# EAGLE design CD (EAGLE 7.2.0)

## Sheet 1 of 3
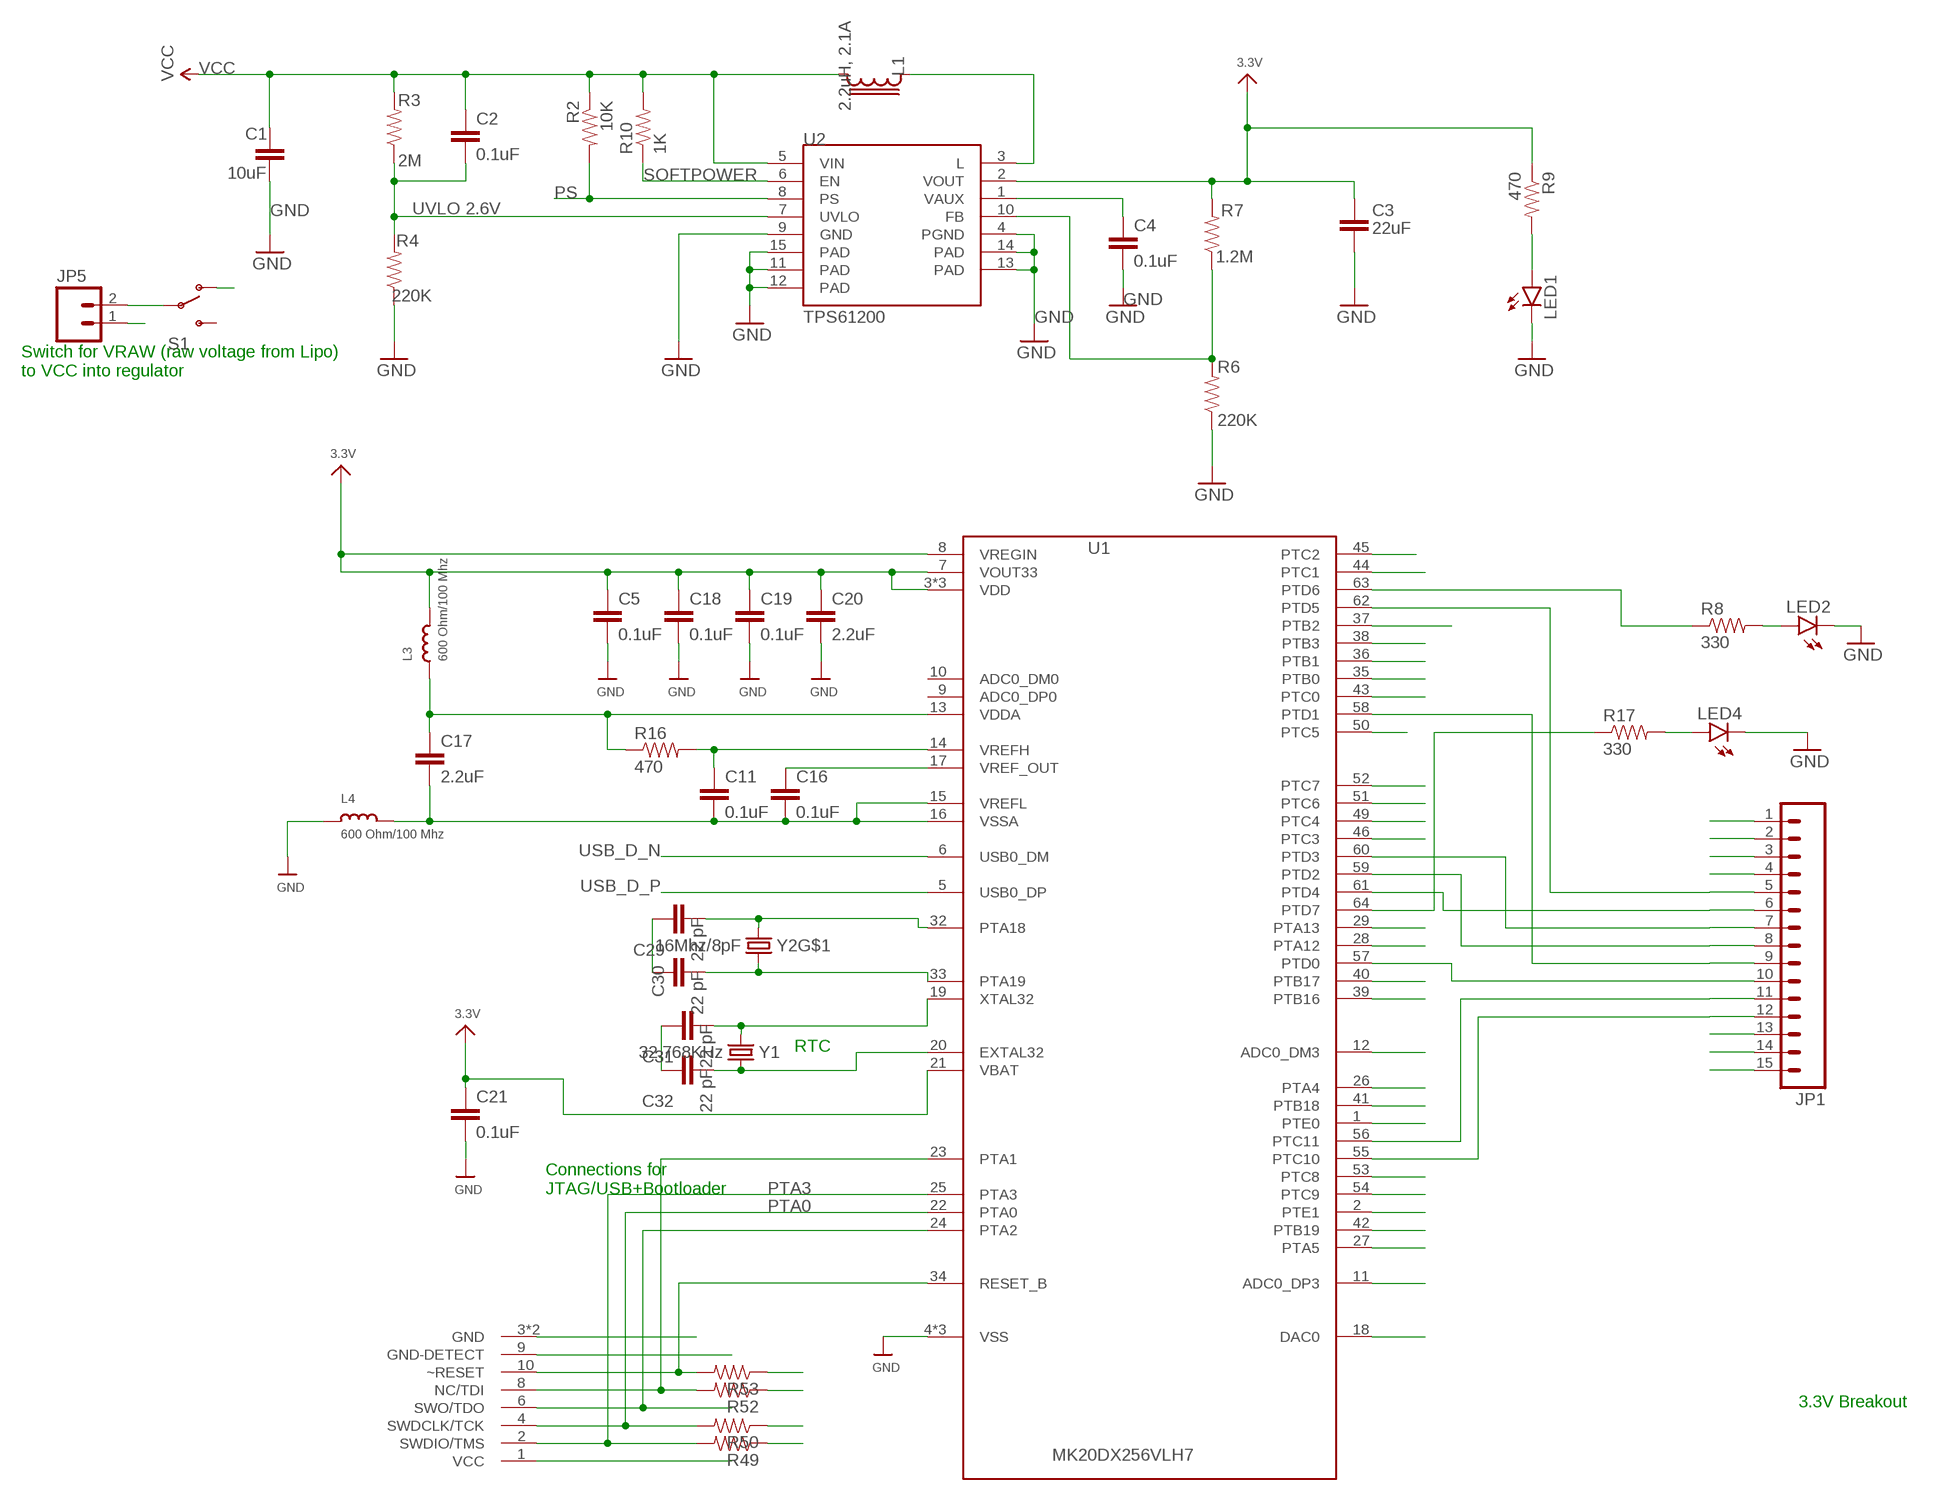
[diagram p0: schematic, sheet 1]

### Parts
C1  10uF  CAPACITOR-10UF  [0603-CAP]
C2  0.1uF  CAPACITOR-0.1UF  [0603-CAP]
C3  22uF  CAPACITOR-22UF  [0603-CAP]
C4  0.1uF  CAPACITOR-0.1UF  [0603-CAP]
C5  0.1uF  CAPACITOR-0.1UF  [0603-CAP]
C11  0.1uF  CAPACITOR-0.1UF  [0603-CAP]
C16  0.1uF  CAPACITOR-0.1UF  [0603-CAP]
C17  2.2uF  CAPACITOR-2.2UF  [0603-CAP]
C18  0.1uF  CAPACITOR-0.1UF  [0603-CAP]
C19  0.1uF  CAPACITOR-0.1UF  [0603-CAP]
C20  2.2uF  CAPACITOR-2.2UF  [0603-CAP]
C21  0.1uF  CAPACITOR-0.1UF  [0603-CAP]
C29  22 pF  CAPACITOR-10UF  [0603-CAP]
C30  22 pF  CAPACITOR-10UF  [0603-CAP]
C31  22 pF  CAPACITOR-10UF  [0603-CAP]
C32  22 pF  CAPACITOR-10UF  [0603-CAP]
JP1  M15  [1X15]
JP5  M02PTH  [1X02]
L1  2.2uH, 2.1A  LPS30152.2UH  [LPS3015]
L3  600 Ohm/100 Mhz  INDUCTOR-BK2125HM601-T  [0805]
L4  600 Ohm/100 Mhz  INDUCTOR-BK2125HM601-T  [0805]
LED1  LED-GREEN  [LED-0603]
LED2  LED-GREEN  [LED-0603]
LED4  LED-GREEN  [LED-0603]
R2  10K  RESISTOR-10K  [0603-RES]
R3  2M  RESISTOR-2M  [0603-RES]
R4  220K  RESISTOR-220K  [0603-RES]
R6  220K  RESISTOR-220K  [0603-RES]
R7  1.2M  RESISTOR-1.2M  [0603-RES]
R8  330  RESISTOR-470  [0603-RES]
R9  470  RESISTOR-470  [0603-RES]
R10  1K  RESISTOR-1K  [0603-RES]
R16  470  RESISTOR-470  [0603-RES]
R17  330  RESISTOR-470  [0603-RES]
R49  RESISTOR0402-RES  [0402-RES]
R50  RESISTOR0402-RES  [0402-RES]
R52  RESISTOR0402-RES  [0402-RES]
R53  RESISTOR0402-RES  [0402-RES]
S1  SWITCH-SPDT-SMD-A  [SWITCH-SPST-SMD-A]
U1  MK20DX256VLH7  [MK20DX256VLH7]
U2  TPS61200  [QFN-10_PAD]
U$7  2X5_0.05"_CORTEX_DEBUGTH_NOKEY_UNSHROUDED  [2X5_0.05"_TH_NS]
Y1  32.768KHz  CRYSTAL/32.768KHZ/SMD-TXC_7A  [CRYSTAL-TXC-7A]
Y2  16Mhz/8pF  CRYSTAL/SMD-5X3-GND16MHZ/8PF  [CRYSTAL-SMD-5X3]

### Nets
3.3V: C3.1 C5.1 C18.1 C19.1 C20.1 C21.1 JP1.13 JP1.14 JP1.15 L3.2 R7.2 R9.1 R49.1 R52.1 R53.1 U1.3(VDD) U1.7(VOUT33) U1.8(VREGIN) U1.21(VBAT) U1.30(VDD) U1.48(VDD) U2.2(VOUT) U$7.1(VCC) ; also sheet 2,3
A12: U1.11(ADC0_DP3)
A13: U1.12(ADC0_DM3)
AD0: U1.45(PTC2) ; also sheet 2
DAC/A14: U1.18(DAC0)
FB: R6.2 R7.1 U2.10(FB)
GND [Top GND Pour]: C1.2 C3.2 C4.2 C5.2 C18.2 C19.2 C20.2 C21.2 C29.1 C30.1 C31.1 C32.1 JP1.1 JP1.2 JP1.3 JP1.4 JP5.1 L4.1 LED1.C LED2.C LED4.C R4.1 R6.1 R50.1 U1.4(VSS) U1.31(VSS) U1.47(VSS) U2.4(PGND) U2.9(GND) U2.11(PAD) U2.12(PAD) U2.13(PAD) U2.14(PAD) U2.15(PAD) U$7.3(GND) U$7.5(GND) U$7.9(GND-DETECT) ; also sheet 2,3
N$1: LED1.A R9.2
N$2: L1.1 U2.3(L)
N$7: LED2.A R8.2
N$10: C31.2 U1.19(XTAL32) Y1.P$2
N$11: C32.2 U1.20(EXTAL32) Y1.P$1
N$27: C29.2 U1.32(PTA18) Y2.3
N$28: C30.2 U1.33(PTA19) Y2.1
N$29: LED4.A R17.2
PS: R2.2 U2.8(PS)
PTA0: R50.2 U1.22(PTA0) U$7.4(SWDCLK/TCK)
PTA1: R52.2 U1.23(PTA1) U$7.8(NC/TDI)
PTA2: U1.24(PTA2) U$7.6(SWO/TDO)
PTA3: R49.2 U1.25(PTA3) U$7.2(SWDIO/TMS)
PTA4: U1.26(PTA4)
PTA5: U1.27(PTA5)
PTA12: U1.28(PTA12)
PTA13: U1.29(PTA13)
PTB0: U1.35(PTB0) ; also sheet 2
PTB1: U1.36(PTB1) ; also sheet 2
PTB16: U1.39(PTB16) ; also sheet 2
PTB17: U1.40(PTB17) ; also sheet 2
PTB18: U1.41(PTB18) ; also sheet 2
PTB19: U1.42(PTB19) ; also sheet 2
PTC0: U1.43(PTC0) ; also sheet 2
PTC1: U1.44(PTC1) ; also sheet 2
PTC3: U1.46(PTC3) ; also sheet 2
PTC4: U1.49(PTC4) ; also sheet 2
PTC5: U1.50(PTC5) ; also sheet 2
PTC6: U1.51(PTC6) ; also sheet 2
PTC7: U1.52(PTC7) ; also sheet 2
PTC8: U1.53(PTC8) ; also sheet 2
PTC9: U1.54(PTC9) ; also sheet 2
PTC10: JP1.12 U1.55(PTC10)
PTC11: JP1.11 U1.56(PTC11)
PTD0: JP1.10 U1.57(PTD0)
PTD1: JP1.9 U1.58(PTD1)
PTD2: JP1.8 U1.59(PTD2)
PTD3: JP1.7 U1.60(PTD3)
PTD4: JP1.6 U1.61(PTD4)
PTD5: JP1.5 U1.62(PTD5)
PTD6: R8.1 U1.63(PTD6)
PTD7: R17.1 U1.64(PTD7)
PTE0: U1.1(PTE0)
PTE1: U1.2(PTE1)
RESET_B: R53.2 U1.34(RESET_B) U$7.10(~RESET)
SCL: U1.37(PTB2) ; also sheet 2,3
SDA: U1.38(PTB3) ; also sheet 2,3
SOFTPOWER: R10.1 U2.6(EN)
USB_D_N [USB]: U1.6(USB0_DM)
USB_D_P [USB]: U1.5(USB0_DP)
UVLO: C2.2 R3.1 R4.2 U2.7(UVLO)
VAUX: C4.1 U2.1(VAUX)
VCC: C1.1 C2.1 L1.2 R2.1 R3.2 R10.2 S1.1(O) U2.5(VIN)
VDDA: C17.1 L3.1 R16.1 U1.13(VDDA)
VRAW [Top GND Pour]: JP5.2 S1.2(P)
VREF_OUT: C16.1 U1.17(VREF_OUT)
VREFH: C11.1 R16.2 U1.14(VREFH)
VREFL: C11.2 C16.2 C17.2 L4.2 U1.15(VREFL) U1.16(VSSA)
Unconnected: S1.3(S) U1.9(ADC0_DP0) U1.10(ADC0_DM0) Y2.2(GND:GND) Y2.4(GND:GND)

### Notes on the sheet
- UVLO 2.6V
- Switch for VRAW (raw voltage from Lipo) 
  to VCC into regulator
- RTC
- Connections for 
  JTAG/USB+Bootloader
- 3.3V Breakout

## Sheet 2 of 3
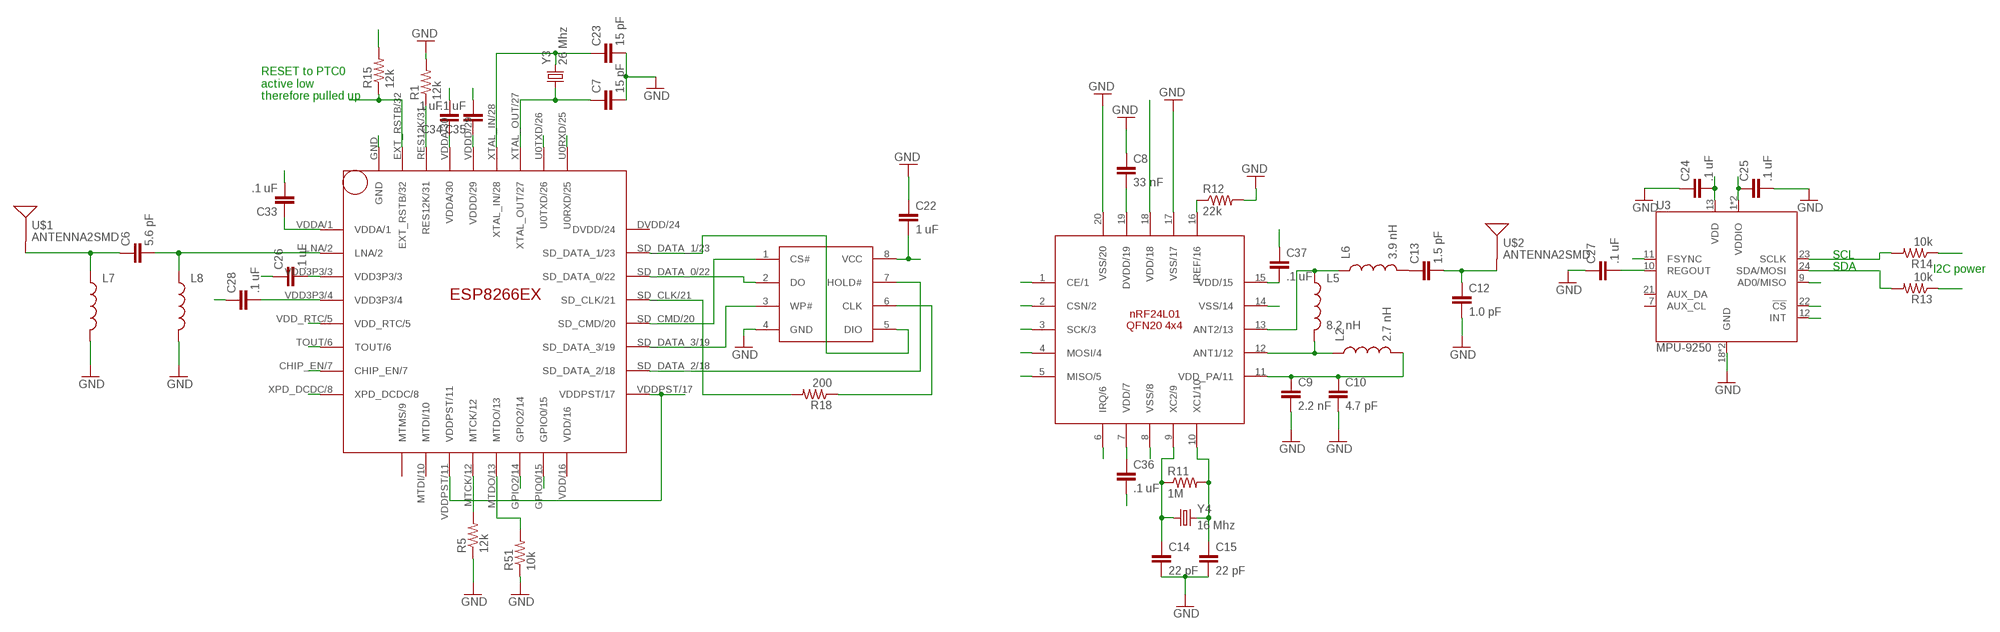
[diagram p1: schematic, sheet 2]

### Parts
C6  5.6 pF  CAP0603-CAP  [0603-CAP]
C7  15 pF  CAP0603-CAP  [0603-CAP]
C8  33 nF  CAP0603-CAP  [0603-CAP]
C9  2.2 nF  CAP0603-CAP  [0603-CAP]
C10  4.7 pF  CAP0603-CAP  [0603-CAP]
C12  1.0 pF  CAP0603-CAP  [0603-CAP]
C13  1.5 pF  CAP0603-CAP  [0603-CAP]
C14  22 pF  CAP0603-CAP  [0603-CAP]
C15  22 pF  CAP0603-CAP  [0603-CAP]
C22  1 uF  CAP0603-CAP  [0603-CAP]
C23  15 pF  CAP0603-CAP  [0603-CAP]
C24  .1 uF  CAP0603-CAP  [0603-CAP]
C25  .1 uF  CAP0603-CAP  [0603-CAP]
C26  .1 uF  CAP0603-CAP  [0603-CAP]
C27  .1 uF  CAP0603-CAP  [0603-CAP]
C28  .1 uF  CAP0603-CAP  [0603-CAP]
C33  .1 uF  CAP0603-CAP  [0603-CAP]
C34  .1 uF  CAP0603-CAP  [0603-CAP]
C35  .1 uF  CAP0603-CAP  [0603-CAP]
C36  .1 uF  CAP0603-CAP  [0603-CAP]
C37  .1 uF  CAP0603-CAP  [0603-CAP]
L2  2.7 nH  INDUCTOR0402  [C0402]
L5  8.2 nH  INDUCTOR0402  [C0402]
L6  3.9 nH  INDUCTOR0402  [C0402]
L7  INDUCTOR30OHM,1.8A  [0603]
L8  INDUCTOR30OHM,1.8A  [0603]
R1  12k  RESISTOR0603-RES  [0603-RES]
R5  12k  RESISTOR0603-RES  [0603-RES]
R11  1M  RESISTOR0603-RES  [0603-RES]
R12  22k  RESISTOR0603-RES  [0603-RES]
R13  10k  RESISTOR0603-RES  [0603-RES]
R14  10k  RESISTOR0603-RES  [0603-RES]
R15  12k  RESISTOR0603-RES  [0603-RES]
R18  200  RESISTOR0603-RES  [0603-RES]
R51  10k  RESISTOR0603-RES  [0603-RES]
U3  MPU-9250  [QFN-24/3MM]
U$1  ANTENNA2SMD  [ANTENNA-CHIP2]
U$2  ANTENNA2SMD  [ANTENNA-CHIP2]
U$3  25Q40  [SOP8]
U$4  NRF24L01  [QFN20(4X4)]
U$6  ESP8266EX  [QFN32]
Y3  26 Mhz  CRYSTAL5X3  [CRYSTAL-SMD-5X3]
Y4  16 Mhz  CRYSTAL5X3  [CRYSTAL-SMD-5X3]

### Nets
3.3V: C22.2 C24.2 C25.1 C26.2 C28.2 C33.1 C34.1 C35.1 C36.1 C37.2 R13.1 R14.1 R15.2 U3.1(VDDIO) U3.8(VDDIO) U3.13(VDD) U3.22(!CS) U$3.8(VCC) U$4.7(VDD/7) U$4.15(VDD/15) U$4.18(VDD/18) U$6.VDD3P3/3 U$6.VDD3P3/4 U$6.VDDA/1 U$6.VDDA/30 U$6.VDDD/29 U$6.VDDPST/11 U$6.VDDPST/17 ; also sheet 1,3
AD0: U3.9(AD0/MISO) ; also sheet 1
GND [Top GND Pour]: C7.2 C8.1 C9.2 C10.2 C12.2 C14.2 C15.2 C22.1 C23.2 C24.1 C25.2 C26.1 C27.1 C28.1 C33.2 C34.2 C35.2 C36.2 C37.1 L7.2 L8.2 R1.2 R5.1 R12.2 R51.1 U3.18(GND) U3.20(GND) U$3.4(GND) U$4.8(VSS/8) U$4.14(VSS/14) U$4.17(VSS/17) U$4.20(VSS/20) U$6.GND ; also sheet 1,3
N$8: R51.2 U$6.MTDO/13
N$13: C6.2 L8.1 U$6.LNA/2
N$16: C6.1 L7.1 U$1.FEED(SIGNAL)
N$17: C14.1 R11.1 U$4.9(XC2/9) Y4.1
N$18: C15.1 R11.2 U$4.10(XC1/10) Y4.3
N$19: C9.1 C10.1 L2.2 U$4.11(VDD_PA/11)
N$20: L5.1 L6.1 U$4.13(ANT2/13)
N$21: C8.2 U$4.19(DVDD/19)
N$23: L2.1 L5.2 U$4.12(ANT1/12)
N$24: R12.1 U$4.16(IREF/16)
N$25: C13.1 L6.2
N$26: C12.1 C13.2 U$2.FEED(SIGNAL)
N$32: R5.2 U$6.MTCK/12
N$34: C27.2 U3.10(REGOUT)
N$35: R18.1 U$3.6(CLK)
N$38: R1.1 U$6.RES12K/31
PTB0: U3.12(INT) ; also sheet 1
PTB1: U3.11(FSYNC) ; also sheet 1
PTB16: U$6.U0TXD/26 ; also sheet 1
PTB17: U$6.U0RXD/25 ; also sheet 1
PTB18: U$6.GPIO0/15 ; also sheet 1
PTB19: U$6.GPIO2/14 ; also sheet 1
PTC0: R15.1 U$6.EXT_RSTB/32 ; also sheet 1
PTC1: U$6.CHIP_EN/7 ; also sheet 1
PTC3: U$6.XPD_DCDC/8 ; also sheet 1
PTC4: U$4.2(CSN/2) ; also sheet 1
PTC5: U$4.3(SCK/3) ; also sheet 1
PTC6: U$4.4(MOSI/4) ; also sheet 1
PTC7: U$4.5(MISO/5) ; also sheet 1
PTC8: U$4.6(IRQ/6) ; also sheet 1
PTC9: U$4.1(CE/1) ; also sheet 1
RTC: U$6.VDD_RTC/5
SCL: R14.2 U3.23(SCLK) ; also sheet 1,3
SD-CLK: R18.2 U$6.SD_CLK/21
SD-CMD: U$3.1(CS#) U$6.SD_CMD/20
SD-D0: U$3.2(DO) U$6.SD_DATA_0/22
SD-D1: U$3.5(DIO) U$6.SD_DATA_1/23
SD-D2: U$3.7(HOLD#) U$6.SD_DATA_2/18
SD-D3: U$3.3(WP#) U$6.SD_DATA_3/19
SDA: R13.2 U3.24(SDA/MOSI) ; also sheet 1,3
TOUT: U$6.TOUT/6
XTAL_IN: C23.1 U$6.XTAL_IN/28 Y3.3
XTAL_OUT: C7.1 U$6.XTAL_OUT/27 Y3.1
Unconnected: U3.7(AUX_CL) U3.21(AUX_DA) U$6.DVDD/24 U$6.MTDI/10 U$6.MTMS/9 U$6.VDD/16

### Notes on the sheet
- RESET to PTC0
  active low
  therefore pulled up
- SCL
- I2C power
- SDA

## Sheet 3 of 3
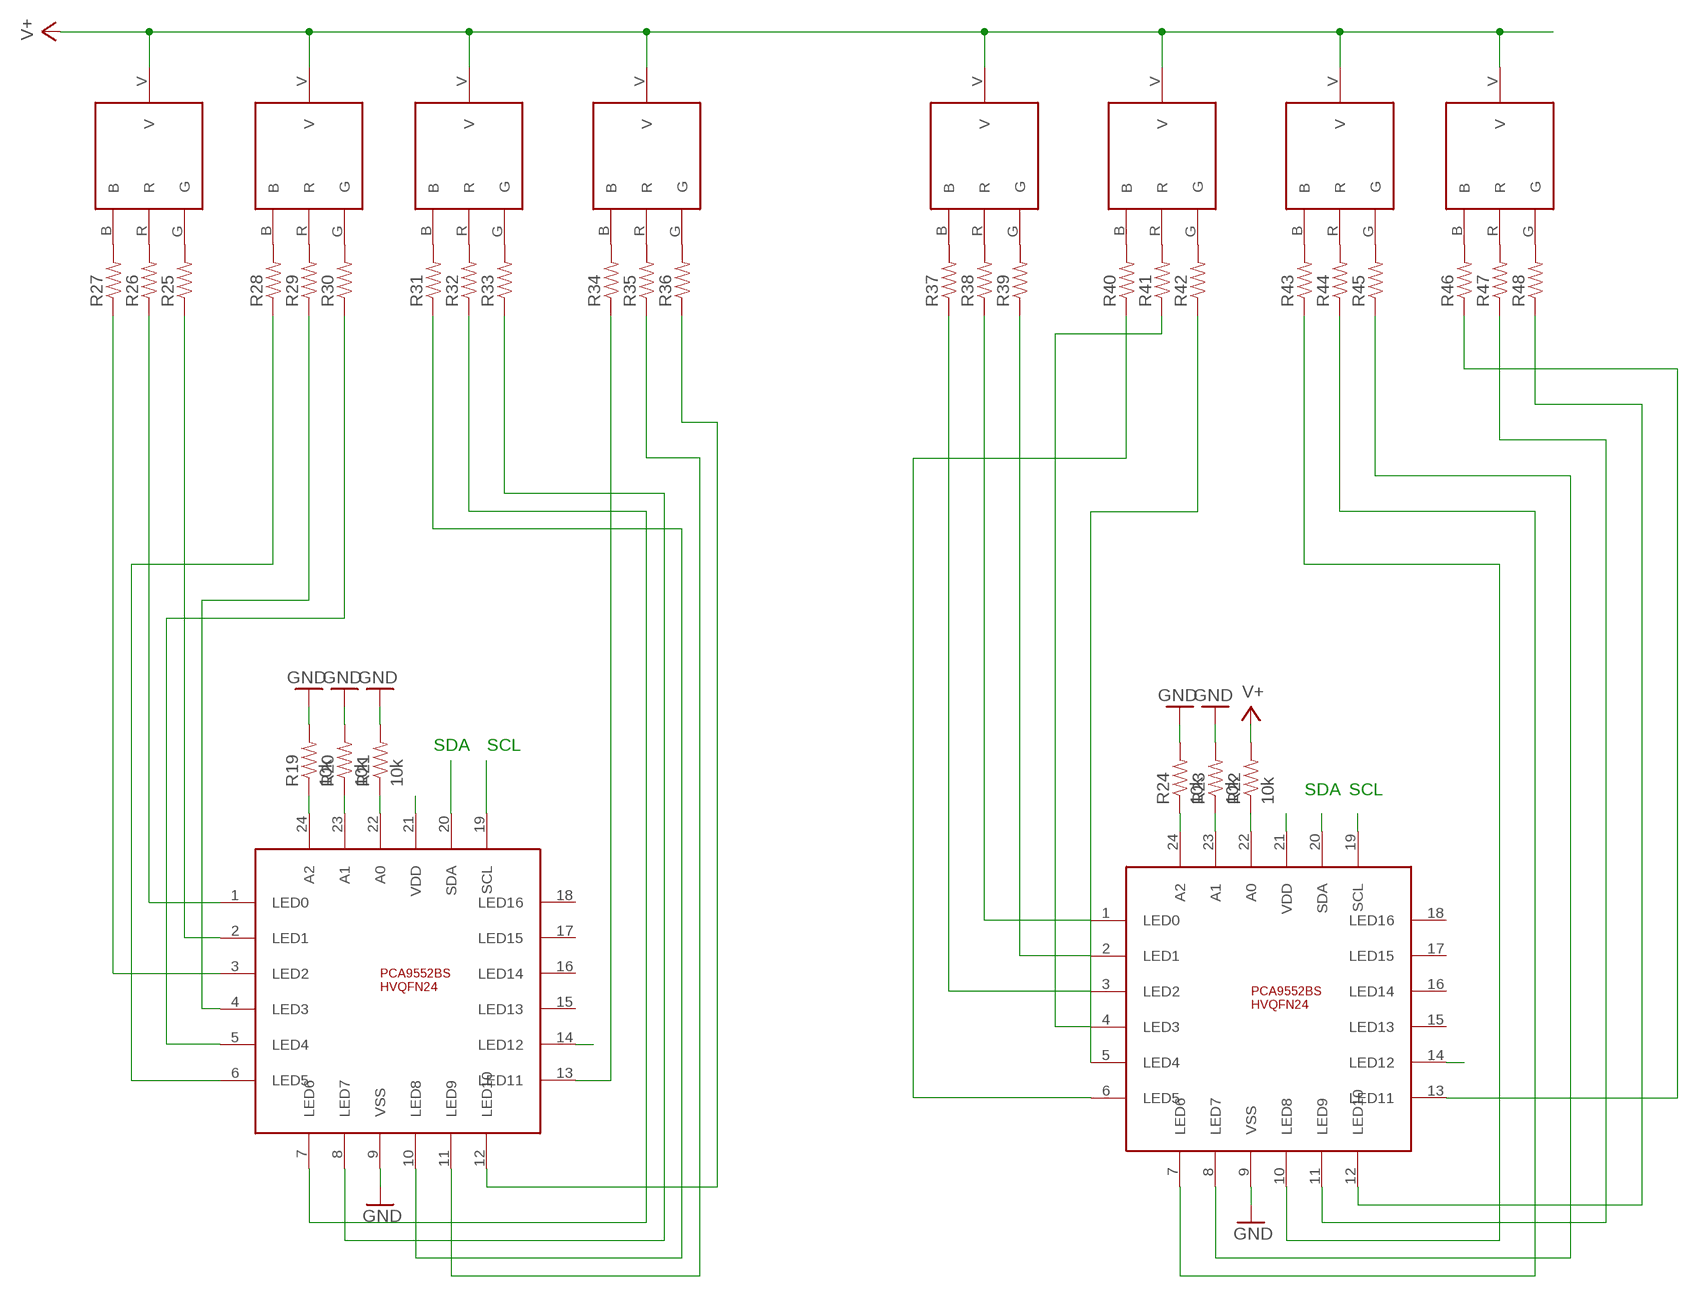
[diagram p2: schematic, sheet 3]

### Parts
R19  10k  RESISTOR0603-RES  [0603-RES]
R20  10k  RESISTOR0603-RES  [0603-RES]
R21  10k  RESISTOR0603-RES  [0603-RES]
R22  10k  RESISTOR0603-RES  [0603-RES]
R23  10k  RESISTOR0603-RES  [0603-RES]
R24  10k  RESISTOR0603-RES  [0603-RES]
R25  RESISTOR0402-RES  [0402-RES]
R26  RESISTOR0402-RES  [0402-RES]
R27  RESISTOR0402-RES  [0402-RES]
R28  RESISTOR0402-RES  [0402-RES]
R29  RESISTOR0402-RES  [0402-RES]
R30  RESISTOR0402-RES  [0402-RES]
R31  RESISTOR0402-RES  [0402-RES]
R32  RESISTOR0402-RES  [0402-RES]
R33  RESISTOR0402-RES  [0402-RES]
R34  RESISTOR0402-RES  [0402-RES]
R35  RESISTOR0402-RES  [0402-RES]
R36  RESISTOR0402-RES  [0402-RES]
R37  RESISTOR0402-RES  [0402-RES]
R38  RESISTOR0402-RES  [0402-RES]
R39  RESISTOR0402-RES  [0402-RES]
R40  RESISTOR0402-RES  [0402-RES]
R41  RESISTOR0402-RES  [0402-RES]
R42  RESISTOR0402-RES  [0402-RES]
R43  RESISTOR0402-RES  [0402-RES]
R44  RESISTOR0402-RES  [0402-RES]
R45  RESISTOR0402-RES  [0402-RES]
R46  RESISTOR0402-RES  [0402-RES]
R47  RESISTOR0402-RES  [0402-RES]
R48  RESISTOR0402-RES  [0402-RES]
U$8  LTST-C19FD1WT  [LTST-C19FD1WT]
U$11  LTST-C19FD1WT  [LTST-C19FD1WT]
U$13  LTST-C19FD1WT  [LTST-C19FD1WT]
U$14  LTST-C19FD1WT  [LTST-C19FD1WT]
U$15  LTST-C19FD1WT  [LTST-C19FD1WT]
U$16  LTST-C19FD1WT  [LTST-C19FD1WT]
U$17  LTST-C19FD1WT  [LTST-C19FD1WT]
U$18  LTST-C19FD1WT  [LTST-C19FD1WT]
U$20  PCA9552BS  [HVQFN24]
U$21  PCA9552BS  [HVQFN24]

### Nets
3.3V: R22.2 U$8.V U$11.V U$13.V U$14.V U$15.V U$16.V U$17.V U$18.V U$20.21(VDD) U$21.21(VDD) ; supply symbol labelled V+ ; also sheet 1,2
GND [Top GND Pour]: R19.2 R20.2 R21.2 R23.2 R24.2 U$20.9(VSS) U$21.9(VSS) ; also sheet 1,2
N$39: R26.2 U$8.R
N$40: R19.1 U$20.24(A2)
N$41: R27.2 U$8.B
N$42: R25.2 U$8.G
N$45: R28.2 U$11.B
N$46: R29.2 U$11.R
N$47: R30.2 U$11.G
N$48: R27.1 U$20.3(LED2)
N$49: R26.1 U$20.1(LED0)
N$50: R31.2 U$13.B
N$51: R28.1 U$20.6(LED5)
N$60: R32.2 U$13.R
N$61: R33.2 U$13.G
N$62: R34.2 U$14.B
N$63: R35.2 U$14.R
N$73: R25.1 U$20.2(LED1)
N$75: R29.1 U$20.4(LED3)
N$76: R30.1 U$20.5(LED4)
N$78: R32.1 U$20.7(LED6)
N$79: R33.1 U$20.8(LED7)
N$80: R31.1 U$20.10(LED8)
N$81: R36.2 U$14.G
N$82: R35.1 U$20.11(LED9)
N$83: R36.1 U$20.12(LED10)
N$84: R34.1 U$20.13(LED11)
N$85: U$20.14(LED12)
N$86: R37.2 U$15.B
N$87: R20.1 U$20.23(A1)
N$88: R21.1 U$20.22(A0)
N$89: R38.2 U$15.R
N$92: R38.1 U$21.1(LED0)
N$93: R39.1 U$21.2(LED1)
N$94: R37.1 U$21.3(LED2)
N$95: R41.1 U$21.4(LED3)
N$96: R42.1 U$21.5(LED4)
N$97: R40.1 U$21.6(LED5)
N$98: R44.1 U$21.7(LED6)
N$99: R45.1 U$21.8(LED7)
N$100: R39.2 U$15.G
N$101: R43.1 U$21.10(LED8)
N$102: R47.1 U$21.11(LED9)
N$103: R48.1 U$21.12(LED10)
N$104: R46.1 U$21.13(LED11)
N$105: U$21.14(LED12)
N$106: R24.1 U$21.24(A2)
N$107: R23.1 U$21.23(A1)
N$108: R22.1 U$21.22(A0)
N$109: R40.2 U$16.B
N$112: R41.2 U$16.R
N$113: R42.2 U$16.G
N$114: R43.2 U$17.B
N$115: R44.2 U$17.R
N$116: R45.2 U$17.G
N$117: R46.2 U$18.B
N$118: R47.2 U$18.R
N$119: R48.2 U$18.G
SCL: U$20.19(SCL) U$21.19(SCL) ; also sheet 1,2
SDA: U$20.20(SDA) U$21.20(SDA) ; also sheet 1,2
Unconnected: U$20.15(LED13) U$20.16(LED14) U$20.17(LED15) U$20.18(LED16) U$21.15(LED13) U$21.16(LED14) U$21.17(LED15) U$21.18(LED16)

### Notes on the sheet
- SDA | SCL
- SDA | SCL

## Library data of the parts
C1 = appfruits:CAPACITOR; MF: Murata; MPN: GRM188R60J106ME47D
C2 C4 C5 C11 C16 C18 C19 C21 = appfruits:CAPACITOR; MF: Kemet; MPN: C0603C104J3RACTU
C3 = appfruits:CAPACITOR; MF: Murata; MPN: GRM188R60J226MEA0D
C6-C10 C12-C15 C22-C28 C33-C37 = SparkFun-Capacitors:CAP: Capacitor Standard 0603 ceramic capacitor, and 0.1" leaded capacitor.
C17 C20 = appfruits:CAPACITOR; MF: Kemet; MPN: C0603C225K4PACTU
C29-C32 = appfruits:CAPACITOR; MF: Murata; MPN: GRM188R60J106ME47D; VALUE: 10uF
JP1 = SparkFun-Connectors:M15: Header 15 Standard 15-pin 0.1" header. Use with straight break away headers (SKU : PRT-00116), right angle break away headers (PRT-00553), swiss pins (PRT-00743), machine pins (PRT-00117), and female headers (PRT-00115).
JP5 = SparkFun-Connectors:M02: Standard 2-pin 0.1" header. Use with - straight break away headers ( PRT-00116) - right angle break away headers (PRT-00553) - swiss pins (PRT-00743) - machine pins (PRT-00117) - female headers (PRT-00115) Molex polarized connector foot print use with: PRT-08233 with associated crimp pins and housings. 2.54_SCREWTERM for use with PRT-10571. 3.5mm Screw Terminal footprints for PRT-08084 5mm Screw Terminal footprints for use with PRT-08432
L1 = appfruits:LPS3015: Shielded Power Inductor; MF: Coilcraft; MPN: LPS3015-222MRB
L2 L5 L6 = SparkFun-Passives:INDUCTOR: Inductors
L3 L4 = appfruits:INDUCTOR: Inductors; MF: Taiyo Yuden; MPN: BK2125HM601-T
L7 L8 = SparkFun-Passives:INDUCTOR: Inductors; PROD_ID: RES-07859
LED1 LED2 LED4 = appfruits:LED: LEDs Standard schematic elements and footprints for 5mm, 3mm, 1206, and 0603 sized LEDs. 5mm - Spark Fun Electronics SKU : COM-00529 (and others); MF: Avago; MPN: HSMG-C190
R1 R5 R11-R15 R18 R51 = SparkFun-Resistors:RESISTOR: Resistor
R2 = appfruits:RESISTOR: Resistor; MF: Panasonic; MPN: ERJ-3GEYJ103V
R3 = appfruits:RESISTOR: Resistor; MF: Panasonic; MPN: ERJ-3GEYJ205V
R4 R6 = appfruits:RESISTOR: Resistor; MF: Panasonic; MPN: ERJ-3GEYJ224V
R7 = appfruits:RESISTOR: Resistor; MF: Panasonic; MPN: ERJ-3GEYJ125V
R8 R17 = appfruits:RESISTOR: Resistor; MF: Panasonic; MPN: ERJ-3GEYJ471V; VALUE: 470
R9 R16 = appfruits:RESISTOR: Resistor; MF: Panasonic; MPN: ERJ-3GEYJ471V
R10 = appfruits:RESISTOR: Resistor; MF: Panasonic; MPN: ERJ-3GEYJ102V
R19-R50 R52 R53 = SparkFun:RESISTOR: Resistor
S1 = SparkFun-Electromechanical:SWITCH-SPDT: SPDT Switch Simple slide switch, Spark Fun Electronics SKU : COM-00102 DPDT SMT slide switch, AYZ0202, SWCH-08179
U1 = appfruits:MK20DX256VLH7; MF: Freescale; MPN: MK20DX256VLH7
U2 = appfruits:TPS61200: DC to DC Booster IC-10035; MF: Texas Instruments; MPN: TPS61200DRCR; PROD_ID: IC-10035
U3 = chips:MPU-9250: GYRO/ACCEL/COMPASS/9-AXIS; DIGIKEY: 1428-1019-1-ND
U$1 U$2 = SparkFun-RF:ANTENNA2: Chip antenna Single endded antenna. Common with smaller chip antennas. CHIP4 package is the GPS Chip Antenna SKU: GPS-08418. CHIP5 package is 2.4GHz chip antenna SKU: WRL-00144.
U$3 = wifi:25Q40
U$4 = RF:NRF24L01
U$6 = wifi:ESP8266EX
U$7 = con-cortex:2X5_0.05"_CORTEX_DEBUG
U$8 U$11 U$13-U$18 = led:LTST-C19FD1WT
U$20 U$21 = NXP_By_element14_Batch_1:PCA9552BS
Y1 = appfruits:CRYSTAL/32.768KHZ/SMD-TXC_7A; MF: Epson Timing; MPN: FC-255 32.7680K-A3
Y2 = appfruits:CRYSTAL/SMD-5X3-GND; MF: ECS; MPN: ECS-160-8-30B-CKM
Y3 Y4 = SparkFun-FreqCtrl:CRYSTAL: Various standard crystals. Proven footprints.; PROD_ID: XTAL-08218

## Net classes
1 USB: width 0.254 mm, drill 0.33 mm, clearance 0.159 mm

## Board
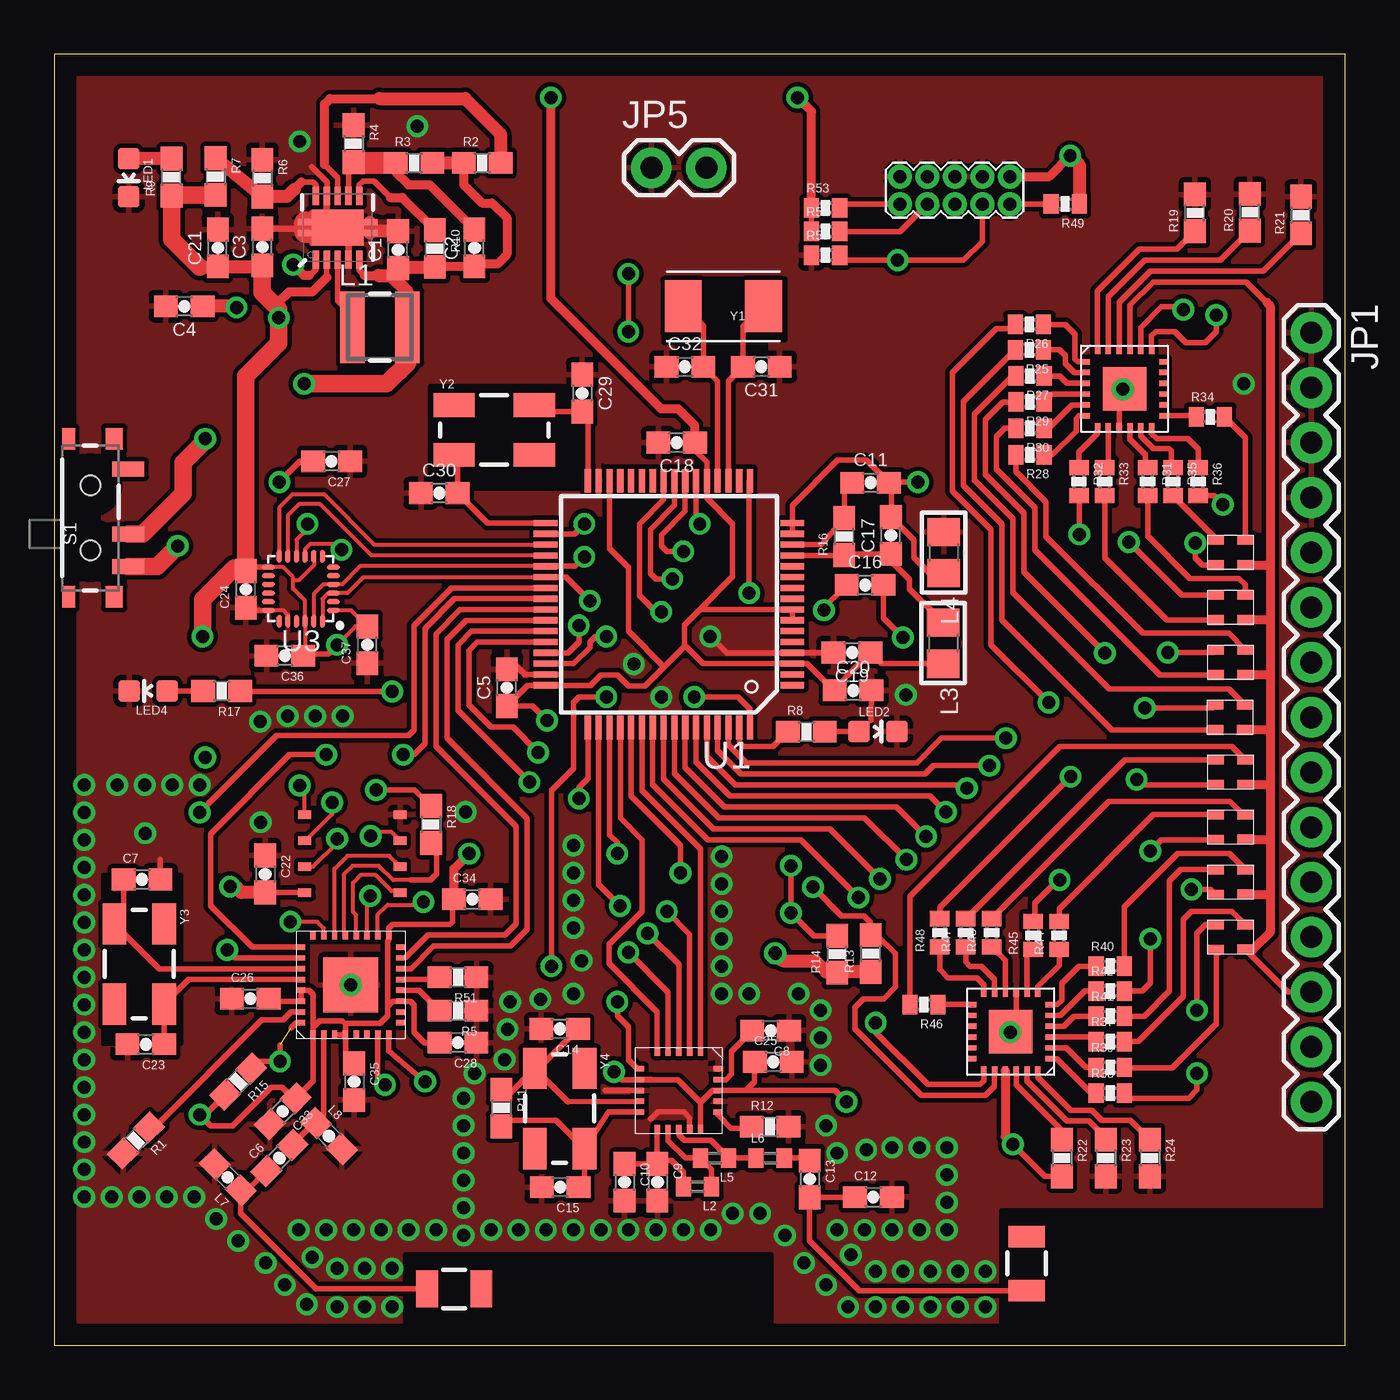
[diagram p3: board, top side]
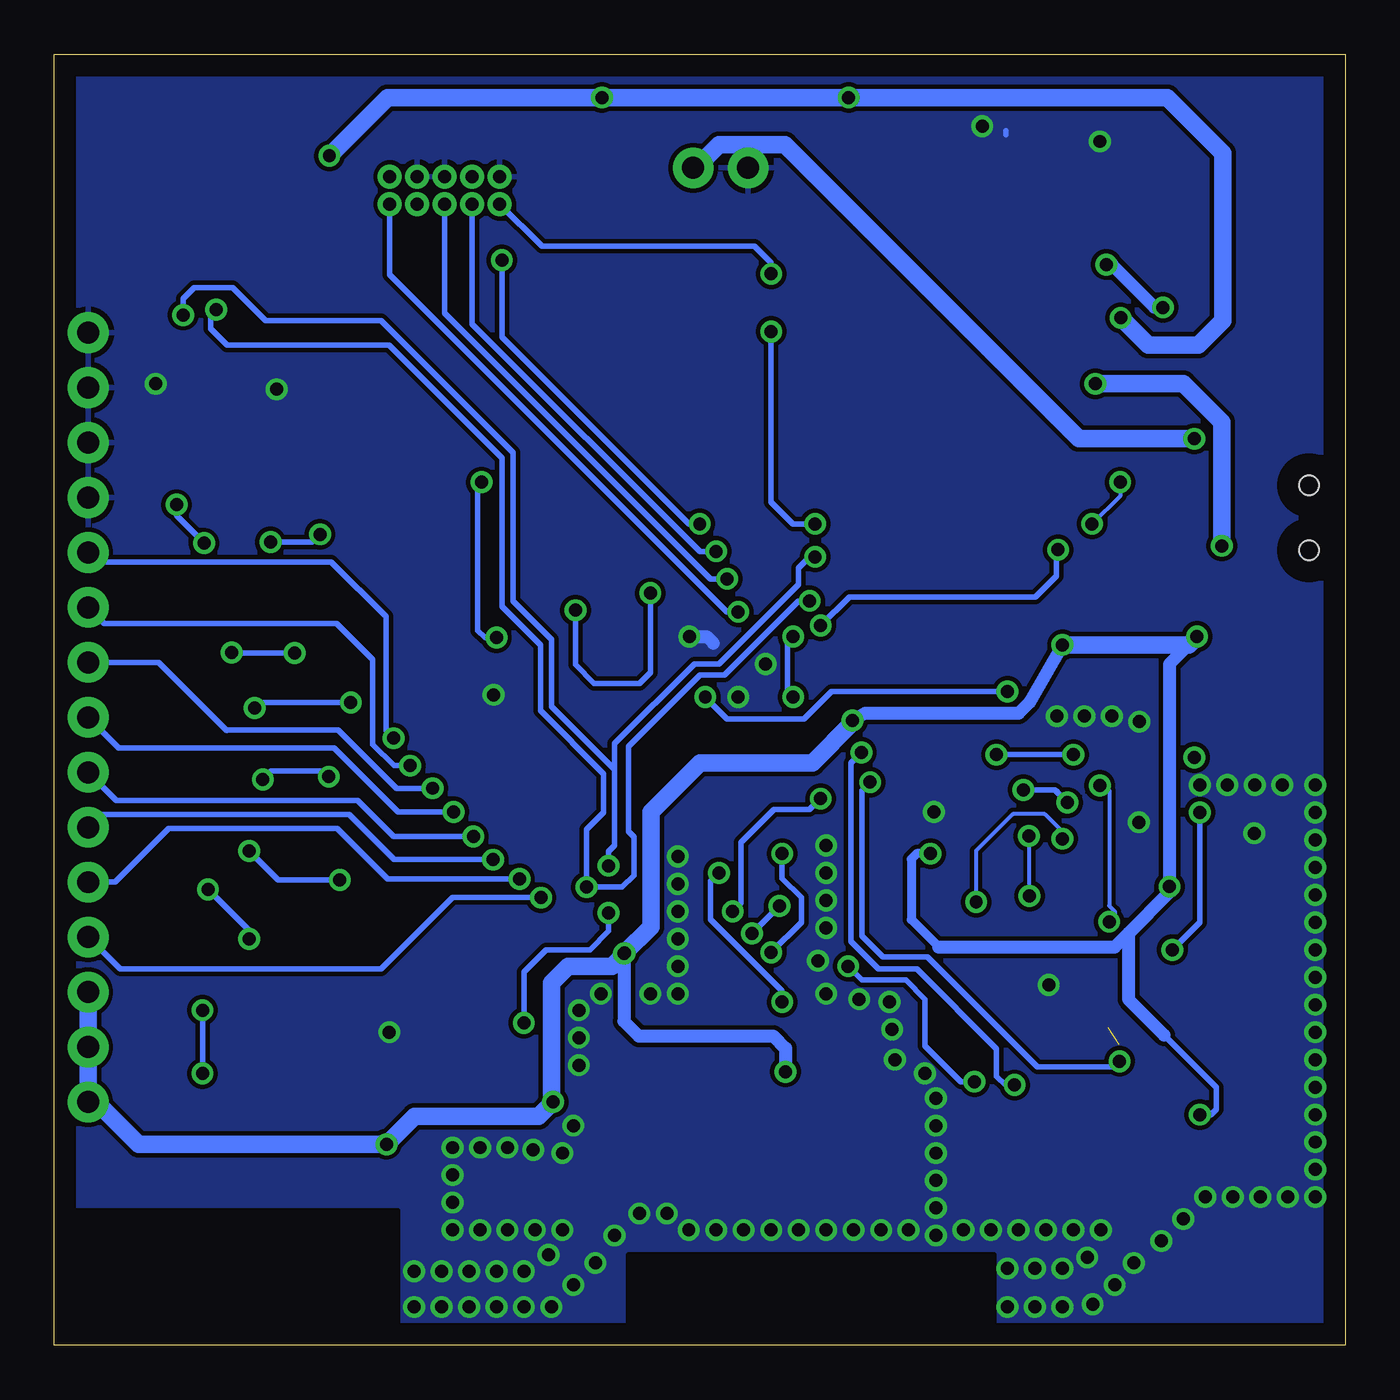
[diagram p4: board, bottom side, seen from below]

Size 59.69 x 59.69 mm. Coordinates in mm from the lower left corner, seen from the top.
Outline: 0,0 59.69,0 59.69,59.69 0,59.69 0,0
Copper layers (1*16): Top 0.035mm / dielectric 1.5mm / Bottom 0.035mm
Design rules "default": minimum track width 10mil, minimum drill 24mil, track to track 8mil, track to pad 8mil, pad to pad 8mil, via to via 8mil, smd to smd 8mil, copper to edge 40mil, drill to drill 8mil, minimum pad ring 10mil, minimum via ring 8mil, stop-mask expansion 4mil, vias tented up to drill 0mil, thermal gap 10mil
tRestrict: area 2.3,14 to 5.8,21.7; area 17.4,39.6 to 24.4,44.3; area 28.2,44.8 to 33.8,49.3; area 43.8,0.1 to 59.6,6.2; area 16.3,0.3 to 33.1,4.2
bRestrict: area 43.8,0.1 to 59.6,6.2; area 16.3,0.3 to 33.1,4.2

### Footprints (pad centres in the part's own frame; a part is rotated, then mirrored left to right if it is on the bottom)
0603-CAP = smd 1.1 x 1: 1 -0.85,0; 2 0.85,0
1X15 = drill 1.016 pad 1.88: 1 0,0; 2 2.54,0; 3 5.08,0; 4 7.62,0; 5 10.16,0; 6 12.7,0; 7 15.24,0; 8 17.78,0; 9 20.32,0; 10 22.86,0; 11 25.4,0; 12 27.94,0; 13 30.48,0; 14 33.02,0; 15 35.56,0
1X02 = drill 1.016 pad 1.88: 1 0,0; 2 2.54,0
LPS3015 = smd 1.14 x 3.3: 1 -1.27,0; 2 1.27,0
C0402 = smd 0.7 x 0.9: 1 -0.65,0; 2 0.65,0
0805 = smd 1.3 x 1.5: 1 -0.95,0; 2 0.95,0
0603 = smd 1.1 x 1: 1 -0.85,0; 2 0.85,0
LED-0603 = smd 1 x 1: A 0,-0.877; C 0,0.877
0603-RES = smd 1.1 x 1: 1 -0.85,0; 2 0.85,0
0402-RES = smd 0.7 x 0.9: 1 -0.65,0; 2 0.65,0
SWITCH-SPST-SMD-A = smd 0.7 x 1.5: 1 -2.25,-1.75; 2 -0.75,-1.75; 3 2.25,-1.75 | smd 1 x 0.6: GND1 -3.65,1; GND3 3.65,1 | smd 1 x 0.8: GND2 -3.65,-1.1; GND4 3.65,-1.1 | hole 0.9: -1.5,0; 1.5,0
MK20DX256VLH7 = smd 1.1 x 0.285: 1 -5.7,3.75; 2 -5.7,3.25; 3 -5.7,2.75; 4 -5.7,2.25; 5 -5.7,1.75; 6 -5.7,1.25; 7 -5.7,0.75; 8 -5.7,0.25; 9 -5.7,-0.25; 10 -5.7,-0.75; 11 -5.7,-1.25; 12 -5.7,-1.75; 13 -5.7,-2.25; 14 -5.7,-2.75; 15 -5.7,-3.25; 16 -5.7,-3.75; 33 5.7,-3.75; 34 5.7,-3.25; 35 5.7,-2.75; 36 5.7,-2.25; 37 5.7,-1.75; 38 5.7,-1.25; 39 5.7,-0.75; 40 5.7,-0.25; 41 5.7,0.25; 42 5.7,0.75; 43 5.7,1.25; 44 5.7,1.75; 45 5.7,2.25; 46 5.7,2.75; 47 5.7,3.25; 48 5.7,3.75 | smd 0.285 x 1.1: 17 -3.75,-5.7; 18 -3.25,-5.7; 19 -2.75,-5.7; 20 -2.25,-5.7; 21 -1.75,-5.7; 22 -1.25,-5.7; 23 -0.75,-5.7; 24 -0.25,-5.7; 25 0.25,-5.7; 26 0.75,-5.7; 27 1.25,-5.7; 28 1.75,-5.7; 29 2.25,-5.7; 30 2.75,-5.7; 31 3.25,-5.7; 32 3.75,-5.7; 49 3.75,5.7; 50 3.25,5.7; 51 2.75,5.7; 52 2.25,5.7; 53 1.75,5.7; 54 1.25,5.7; 55 0.75,5.7; 56 0.25,5.7; 57 -0.25,5.7; 58 -0.75,5.7; 59 -1.25,5.7; 60 -1.75,5.7; 61 -2.25,5.7; 62 -2.75,5.7; 63 -3.25,5.7; 64 -3.75,5.7
QFN-10_PAD = smd 0.297 x 0.85: 1 -1,-1.475; 2 -0.5,-1.475; 3 0,-1.475; 4 0.5,-1.475; 5 1,-1.475; 6 1,1.475; 7 0.5,1.475; 8 0,1.475; 9 -0.5,1.475; 10 -1,1.475 | smd 0.7 x 0.28: 11 -1.5,0.25; 12 -1.5,-0.25; 13 1.5,0.25; 14 1.5,-0.25 | smd 2.4 x 1.65: 15 0,0
QFN-24/3MM = smd 0.6 x 0.23: 1 -1.5,1; 2 -1.5,0.6; 3 -1.5,0.2; 4 -1.5,-0.2; 5 -1.5,-0.6; 6 -1.5,-1; 13 1.5,-1; 14 1.5,-0.6; 15 1.5,-0.2; 16 1.5,0.2; 17 1.5,0.6; 18 1.5,1 | smd 0.23 x 0.6: 7 -1,-1.5; 8 -0.6,-1.5; 9 -0.2,-1.5; 10 0.2,-1.5; 11 0.6,-1.5; 12 1,-1.5; 19 1,1.5; 20 0.6,1.5; 21 0.2,1.5; 22 -0.2,1.5; 23 -0.6,1.5; 24 -1,1.5
ANTENNA-CHIP2 = smd 1.7 x 1: FEED 0,1.25; P$2 0,-1.25
SOP8 = smd 0.6 x 0.4: 1 -2.2,1.8; 2 -2.2,0.6; 3 -2.2,-0.6; 4 -2.2,-1.8; 5 2.2,-1.8; 6 2.2,-0.6; 7 2.2,0.6; 8 2.2,1.8
QFN20(4X4) = smd 0.4 x 0.25: 1 -1.8,1; 2 -1.8,0.5; 3 -1.8,0; 4 -1.8,-0.5; 5 -1.8,-1; 11 1.8,-1; 12 1.8,-0.5; 13 1.8,0; 14 1.8,0.5; 15 1.8,1 | smd 0.25 x 0.4: 6 -1,-1.8; 7 -0.5,-1.8; 8 0,-1.8; 9 0.5,-1.8; 10 1,-1.8; 16 1,1.8; 17 0.5,1.8; 18 0,1.8; 19 -0.5,1.8; 20 -1,1.8
QFN32 = smd 0.4 x 0.25: CHIP_EN/7 -2.3,-1.25; DVDD/24 2.3,1.75; LNA/2 -2.3,1.25; SD_CLK/21 2.3,0.25; SD_CMD/20 2.3,-0.25; SD_DATA_0/22 2.3,0.75; SD_DATA_1/23 2.3,1.25; SD_DATA_2/18 2.3,-1.25; SD_DATA_3/19 2.3,-0.75; TOUT/6 -2.3,-0.75; VDD3P3/3 -2.3,0.75; VDD3P3/4 -2.3,0.25; VDD_RTC/5 -2.3,-0.25; VDDA/1 -2.3,1.75; VDDPST/17 2.3,-1.75; XPD_DCDC/8 -2.3,-1.75 | smd 0.25 x 0.4: EXT_RSTB/32 -1.75,2.3; GPIO0/15 1.25,-2.3; GPIO2/14 0.75,-2.3; MTCK/12 -0.25,-2.3; MTDI/10 -1.25,-2.3; MTDO/13 0.25,-2.3; MTMS/9 -1.75,-2.3; RES12K/31 -1.25,2.3; U0RXD/25 1.75,2.3; U0TXD/26 1.25,2.3; VDD/16 1.75,-2.3; VDDA/30 -0.75,2.3; VDDD/29 -0.25,2.3; VDDPST/11 -0.75,-2.3; XTAL_IN/28 0.25,2.3; XTAL_OUT/27 0.75,2.3 | smd 2.54 x 2.54: GND 0,0
2X5_0.05"_TH_NS = drill 0.6 pad 0.95: 1 -2.54,-0.635; 2 -2.54,0.635; 3 -1.27,-0.635; 4 -1.27,0.635; 5 0,-0.635; 6 0,0.635; 7 1.27,-0.635; 8 1.27,0.635; 9 2.54,-0.635; 10 2.54,0.635
LTST-C19FD1WT = smd 0.75 x 0.45: B 0.68,0.58; G -0.68,-0.58; P$5 0.68,-0.58; R -0.68,0.58; V 0.68,-0.57
HVQFN24 = smd 0.4 x 0.25: 1 -1.8,1.25; 2 -1.8,0.75; 3 -1.8,0.25; 4 -1.8,-0.25; 5 -1.8,-0.75; 6 -1.8,-1.25; 13 1.8,-1.25; 14 1.8,-0.75; 15 1.8,-0.25; 16 1.8,0.25; 17 1.8,0.75; 18 1.8,1.25 | smd 0.25 x 0.4: 7 -1.25,-1.8; 8 -0.75,-1.8; 9 -0.25,-1.8; 10 0.25,-1.8; 11 0.75,-1.8; 12 1.25,-1.8; 19 1.25,1.8; 20 0.75,1.8; 21 0.25,1.8; 22 -0.25,1.8; 23 -0.75,1.8; 24 -1.25,1.8 | smd 2 x 2: P$1 0,0
CRYSTAL-TXC-7A = smd 1.7 x 2.4: P$1 1.85,0; P$2 -1.85,0
CRYSTAL-SMD-5X3 = smd 1.9 x 1.1: 1 -1.85,-1.15; 2 1.85,-1.15; 3 1.85,1.15; 4 -1.85,1.15

### Placement (x,y rotation side)
C1  15.9,50.65 90 top
C2  19.43,50.72 90 top
C3  9.63,50.77 90 top
C4  6.02,48.03 180 top
C5  20.93,30.4 90 top
C6  10.41,8.66 45 top
C7  4.06,21.54 0 top
C8  33.12,14.55 180 top
C9  27.89,7.54 270 top
C10  26.37,7.54 270 top
C11  37.74,39.88 0 top
C12  37.87,6.86 0 top
C13  34.92,7.7 270 top
C14  23.37,14.63 180 top
C15  23.39,7.32 180 top
C16  37.49,35.15 0 top
C17  38.68,37.44 90 top
C18  28.78,41.73 180 top
C19  36.88,32.03 180 top
C20  36.93,30.28 0 top
C21  7.57,50.72 90 top
C22  9.75,21.79 270 top
C23  4.24,13.92 180 top
C24  8.86,34.95 90 top
C25  33.25,13.11 0 top
C26  9.07,16.03 0 top
C27  12.83,40.87 180 top
C28  18.67,14 180 top
C29  24.41,44.02 270 top
C30  17.81,39.4 0 top
C31  32.69,45.24 180 top
C32  29.16,45.24 0 top
C33  10.57,10.82 225 top
C34  19.33,20.62 0 top
C35  13.87,12.19 270 top
C36  10.67,31.88 180 top
C37  14.48,32.38 90 top
JP1  58.12,46.81 270 top
JP5  27.61,54.43 0 top
L1  15.06,47.07 0 top
L2  29.74,7.34 180 top
L3  41.1,32.46 270 top
L4  41.12,36.65 270 top
L5  30.53,8.66 180 top
L6  33.1,8.66 0 top
L7  8.03,7.77 135 top
L8  12.7,9.68 315 top
LED1  3.45,53.98 180 top
LED2  38.07,28.37 270 top
LED4  4.34,30.25 90 top
R1  3.78,9.47 225 top
R2  19.79,54.66 0 top
R3  16.64,54.66 0 top
R4  13.84,55.55 270 top
R5  18.67,15.47 180 top
R6  9.63,53.95 270 top
R7  7.47,54.03 270 top
R8  34.77,28.37 0 top
R9  5.44,54 90 top
R10  17.6,50.7 270 top
R11  20.68,10.97 270 top
R12  33.1,10.11 0 top
R13  37.74,18.11 90 top
R14  36.2,18.08 90 top
R15  8.51,12.19 225 top
R16  36.53,37.39 90 top
R17  7.75,30.25 180 top
R18  17.42,24.08 270 top
R19  52.73,52.35 90 top
R20  55.27,52.37 90 top
R21  57.63,52.25 90 top
R22  46.58,8.66 270 top
R23  48.62,8.66 270 top
R24  50.65,8.66 270 top
R25  45.09,46.02 180 top
R26  45.09,47.19 180 top
R27  45.11,44.81 180 top
R28  45.11,41.17 180 top
R29  45.11,43.61 180 top
R30  45.11,42.39 180 top
R31  50.55,39.93 270 top
R32  47.37,39.93 270 top
R33  48.56,39.93 270 top
R34  53.44,42.93 0 top
R35  51.71,39.93 270 top
R36  52.88,39.93 270 top
R37  48.82,14.05 0 top
R38  48.82,11.66 0 top
R39  48.82,12.85 0 top
R40  48.82,17.53 0 top
R41  48.82,15.21 0 top
R42  48.82,16.38 0 top
R43  43.33,19.08 90 top
R44  46.46,18.95 90 top
R45  45.26,18.95 90 top
R46  40.21,15.75 180 top
R47  42.14,19.08 90 top
R48  40.94,19.08 90 top
R49  46.74,52.76 180 top
R50  35.66,50.39 0 top
R51  18.67,17.02 180 top
R52  35.66,51.49 0 top
R53  35.66,52.58 0 top
S1  1.68,38.25 90 top
U1  28.42,34.26 180 top
U2  13.11,51.66 0 top
U3  11.4,34.98 180 top
U$1  18.49,2.62 90 top
U$2  44.96,3.78 180 top
U$3  13.79,22.73 180 top
U$4  28.88,11.79 270 top
U$6  13.72,16.66 90 top
U$7  41.63,53.39 180 top
U$8  54.36,29.03 0 top
U$11  54.38,31.57 0 top
U$13  54.38,34.11 0 top
U$14  54.38,36.65 0 top
U$15  54.38,18.87 0 top
U$16  54.38,21.41 0 top
U$17  54.38,23.95 0 top
U$18  54.38,26.49 0 top
U$20  49.48,44.22 0 top
U$21  44.22,14.5 180 top
Y1  30.94,48.03 180 top
Y2  20.35,42.32 0 top
Y3  3.94,17.63 270 top
Y4  23.37,10.95 270 top

### Tracks (layer width: path | path; a pad name or v marks a point on that pad's centre or on a via)
3.3V  (via drill 0.6)
  Top 0.178: 11.05,35.36 11.05,34.98 11.61,34.42 U3.22 11.61,31.8 11.56,31.75 | 11.05,35.36 11.05,35.51 10.58,35.98 U3.13 | U3.8 12.01,36.47 12.01,36.07 11.3,35.36 11.05,35.36 | 11.61,31.96 C36.1 | U3.1 13.74,33.98 C37.2 13.93,33.23 v13.08,32.38 | U$4.7 26.9,12.29
  Top 0.254: U1.21 30.16,39.98 | U1.3 34.13,31.52 | 34.13,31.52 34.8,31.52 36.16,30.16 C20.1 36.65,30.95 C19.1 38.25,31.51 L3.2 | U1.7 U1.8 29.85,34.02 | 34.13,31.52 30,31.52 29.21,32.31 29.13,32.31 | 29.85,34.02 29.16,33.33 29.13,33.33 29.13,32.31 | C24.2 9.04,35.98 U3.13 | U2.2 12.61,49.36 | U$6.VDDA/1 11.97,16.23 11.78,16.41 U$6.VDDD/29 U$6.VDDA/30 10.03,15.91 C26.2 | U$6.VDDA/1 11.97,14.71 12.27,15.01 13.31,15.01 13.47,14.86 | 13.47,14.86 U$6.VDD3P3/4 | U$6.VDD3P3/3 U$6.VDD3P3/4 | 13.47,14.86 13.49,14.88 15.06,14.88 15.42,15.24 15.42,15.67 | 15.42,15.67 15.66,15.91 U$6.VDDPST/11 16.47,15.91 16.64,15.75 16.64,14.48 17.12,13.99 C28.2 | 15.42,15.67 15.42,18.67 15.47,18.72 U$6.VDDPST/17 15.47,19.28 15.65,19.46 18.29,19.46 18.41,19.58 18.41,20.83 | U$4.15 29.88,11.24 | 29.88,11.24 28.84,12.29 U$4.7 26.25,12.29 v25.88,12.65 | JP1.13 57.03,16.33 U$15.V | U$6.VDD3P3/4 13.47,13.44 C35.1 | U$6.VDDA/1 11.97,12.22 C33.1 11.06,11.42 10.54,11.94 10.03,11.94 8.26,10.16 7.24,10.16 v6.73,10.67 6.99,10.67 R15.2 | 55.33,20.84 U$16.V | U$20.21 49.73,48.08 50.8,49.15 55.12,49.15 56.06,48.21 | U1.30 25.67,36.84 26.54,35.97 26.54,33.02 28.19,31.37 | R52.1 R53.1 | U1.21 30.17,39.17 31.37,37.97 31.37,35.53 29.85,34.02 | 11.61,31.96 12.66,31.96 v13.08,32.38 | U$3.8 9.76,20.93 | 29.88,11.24 30.42,11.79 U$4.18 31.98,11.79 | 31.98,11.79 32.38,12.19 32.38,13.09 C25.1 | v36.63,11.25 36.09,11.79 31.98,11.79 | 26.9,12.29 27.61,12.29 | R22.2 45.81,7.81 v44.32,9.3 | v22.78,28.88 22.11,29.55 C5.1 21.27,29.88 21.89,30.5 U1.48 24.8,30.52 25.27,30.99 26.04,30.99 26.54,30.48 27.3,30.48 28.19,31.37 | C18.1 29.63,41.37 30.17,40.82 U1.21
  Top 0.254: 28.19,31.37 29.13,32.31
  Top 0.406: C22.2 9.76,20.93 | 12.61,49.36 11.94,48.69 10.86,48.69 10.39,48.22 v10.39,47.5 | C34.1 18.48,22.04 v19.18,22.73 | U$21.21 43.97,9.65 v44.32,9.3 | U$7.1 46,54.03 v46.97,54.99 | R53.1 35.01,57.04 v34.37,57.68 | v22.96,57.68 22.96,48.39 28.07,43.28 28.85,43.28 29.59,42.55 29.59,41.66 | 56.06,48.21 56.21,48.06 56.21,36.04 | 56.21,36.04 56.21,33.58 | 56.21,33.58 56.21,30.94 | 56.21,30.94 56.21,28.5 | 56.21,28.5 56.21,25.88 | 56.21,25.88 56.21,23.42 | 56.21,23.42 56.21,20.75 | 56.21,20.75 56.21,19.1 55.41,18.3 U$15.V | 55.33,20.84 56.12,20.84 56.21,20.75 | U$17.V 56.17,23.38 56.21,23.42 | U$18.V 56.17,25.92 56.21,25.88 | U$8.V 56.17,28.46 56.21,28.5 | U$11.V 56.15,31 56.21,30.94 | U$13.V 56.17,33.54 56.21,33.58 | U$14.V 56.17,36.08 56.21,36.04
  Top 0.61: R7.2 7.15,53.18 | 6.73,49.84 7.53,49.84 C21.1 9.58,49.87 C3.1 | 9.76,20.93 8.66,20.93 8.38,21.21 v8.13,21.21 | R13.1 36.22,17.26 | 36.22,17.26 R14.1 | v46.97,54.99 47.39,54.57 R49.1 | v33.35,18.11 33.68,17.78 35.18,17.78 35.7,17.26 36.22,17.26
  Top 0.813: 6.73,49.84 5.44,51.13 R9.1 5.46,53.18 R7.2 | C3.1 9.63,48.67 10.39,47.9 v10.39,47.5 10.39,46.33 8.87,44.81 C24.2 8.72,35.94 8.33,35.94 6.86,34.47 v6.86,32.77
  Bottom 0.254: v6.73,10.67 6.22,10.67 5.97,10.92 5.97,11.94 8.38,14.35
  Bottom 0.406: v19.18,22.73 19.81,22.73 20.07,22.48 20.07,19.68 18.8,18.41
  Bottom 0.61: v13.08,32.38 14.61,29.72 15.11,29.21 22.2,29.21 v22.78,28.88 | v25.88,12.65 25.88,13.74 26.44,14.3 32.66,14.3 33.35,14.99 v33.35,18.11 v33.33,18.14 | v6.86,32.77 8.13,31.5 v8.13,21.21 8.13,20.95 10.03,19.05 | 10.03,19.05 10.03,16 8.38,14.35 | 18.8,18.41 10.67,18.41 10.03,19.05
  Bottom 0.813: JP1.13 JP1.14 | JP1.14 57.86,13.54 | JP1.15 JP1.14 | v13.08,32.38 7.24,32.38 v6.86,32.77 | JP1.14 58.12,11.63 55.78,9.3 v44.32,9.3 43.03,10.59 37.29,10.59 v36.63,11.25 36.7,11.33 36.7,16.76 35.94,17.53 33.91,17.53 33.4,18.03 | v22.78,28.88 22.73,28.83 24.64,26.92 29.84,26.92 32.11,24.66 32.11,19.36 v33.33,18.14 | v46.97,54.99 44.27,57.68 v34.37,57.68 v22.96,57.68 8.23,57.68 5.66,55.12 5.66,47.37 6.81,46.23 9.12,46.23 v10.39,47.5
AD0  (via drill 0.6)
  Top 0.178: v13.28,36.78 13.03,37.03 11.84,37.03 11.61,36.8 U3.9
  Top 0.254: U1.45 23.76,32.02 24.26,32.51 v24.26,33.27
  Bottom 0.254: v13.28,36.78 13.36,36.7 13.36,35.56 14.33,34.59 22.94,34.59 v24.26,33.27
FB
  Top 0.254: U2.10 12.11,53.63 11.96,53.77 11.43,53.77
  Top 0.406: 11.43,53.77 11.1,53.44
  Top 0.61: R7.1 R6.2 10.76,53.1 11.1,53.44
GND  (via drill 0.6)
  Top 0.178: U3.20 10.8,33.77 10.62,33.96 9.92,33.96 U3.18 | 11.61,51.46 U2.12 | C5.2 21.45,31.25 21.72,30.99
  Top 0.254: U1.47 21.77,31.01 21.2,31.58 C5.2 | U1.4 34.14,32.03 C19.2 36.01,32 31.11,32 v30.33,32.77 | 37.76,28.89 C20.2 | C24.1 8.99,33.98 U3.18 | U2.9 12.62,53.16 12.62,53.77 11.91,54.48 | 9.93,22.82 C22.1 9.68,22.72 | U$4.8 25.48,11.79 | U$4.14 29.38,10.52 29.11,10.79 27.91,10.79 27.58,10.46 27.56,10.46 | U$6.GND 13.72,17.09 13.49,17.32 | U$21.9 44.47,14.75 v44.2,14.48 | U$20.9 49.23,44.02 v49.4,44.2 | 4.91,22.47 C7.2 | R4.1 13.88,56.36 | C34.2 20.27,20.62
  Top 0.305: U2.9 12.6,53.14 12.6,52.22 13.11,52.22 U2.15 13.61,51.16 U2.4 | C3.2 11.39,51.62 U2.12
  Top 0.406: U2.13 13.93,51.23 13.34,51.23 13.11,51.46 U2.15 | R4.1 13.8,56.44 | 9.59,54.83 R6.1
  Top 0.61: C1.2 14.61,51.5 | 14.61,51.5 U2.13 | 14.61,51.5 U2.14
  Top 1.016: 13.11,51.46 11.61,51.46 U2.11
  Bottom 0.254: 13.92,16.46 U$6.GND | 54.74,44.2 v54.99,44.45 | 15.7,56.16 15.7,55.96
  Bottom 0.61: v30.33,32.77 29.52,32.77 29.21,32.46
  other vias: 39.37,30.07 37.54,9.04 13.72,16.66 9.55,24.18 4.22,23.67 19.02,24.66 16.79,56.36 11.35,55.65 13.34,29.08 12.06,29.08 10.79,29.08 9.53,28.83 6.73,25.91 5.46,25.91 4.19,25.91 2.92,25.91 1.4,25.91 1.4,24.64 1.4,23.37 1.4,22.1 1.4,20.83 1.4,19.56 1.4,18.29 1.4,17.02 1.4,15.75 1.4,14.48 1.4,13.21 1.4,11.94 1.4,10.67 1.4,9.4 1.4,8.13 1.4,6.86 2.67,6.86 3.94,6.86 5.21,6.86 6.48,6.86 7.49,5.84 8.51,4.83 11.3,5.33 12.57,5.33 13.84,5.33 15.11,5.33 16.38,5.33 17.65,5.33 18.92,5.08 18.92,6.35 18.92,7.62 18.92,8.89 18.92,10.16 18.92,11.43 20.83,13.21 20.95,14.61 24,16.26 24,19.3 24,20.57 24,21.84 24,23.11 20.19,5.33 21.46,5.33 22.73,5.33 24,5.33 25.27,5.33 26.54,5.33 27.81,5.33 29.08,5.33 30.35,5.33 31.37,6.1 32.64,6.1 33.78,5.08 36.2,5.33 37.47,5.33 38.73,5.33 40.01,5.33 41.27,5.33 41.27,6.6 41.27,7.87 41.27,9.14 38.73,9.14 40.01,9.14 36.2,8.89 35.69,10.16 35.43,12.95 35.43,14.22 35.43,15.49 34.42,16.26 32.13,16.26 30.86,16.26 30.86,17.53 30.86,18.8 30.86,20.07 30.86,21.34 30.86,22.61 26.8,31.5 28.07,29.97 19.43,12.57 21.08,15.88 22.48,16 24.38,17.78 9.78,3.81 10.67,2.79 11.68,1.91 13.08,1.78 14.35,1.78 15.62,1.78 15.62,3.56 14.35,3.56 13.08,3.56 11.94,4.06 43.05,1.78 43.05,3.43 41.78,1.78 41.78,3.43 40.51,3.43 40.51,1.78 39.24,1.78 39.24,3.43 37.97,3.43 37.97,1.78 36.83,4.19 34.67,3.81 35.69,2.79 36.7,1.78
  pour Top: -1.27,128.65 128.65,128.65 128.65,-0.76 -12.45,-8.89
  pour Bottom: -3.68,128.02 127.64,128.02 127.64,-0.64 -10.49,-6.78
N$1
  Top 0.61: R9.2 LED1.A
N$2
  Top 0.254: U2.3 13.11,48.28 13.79,47.6 L1.1
N$7
  Top 0.254: R8.2 LED2.A
N$8
  Top 0.254: U$6.MTDO/13 17.71,16.91 R51.2
N$10
  Top 0.254: Y1.P$2 31.84,47.08 C31.2 31.17,44.57 U1.19
N$11
  Top 0.254: Y1.P$1 30.01,47.11 C32.2 30.67,44.57 U1.20
N$13
  Top 0.254: C6.2 12.03,10.28 L8.1 12.47,10.64 U$6.LNA/2
N$16
  Top 0.254: U$1.FEED 12.12,2.62 8.63,6.11 L7.1 8.92,7.17 C6.1
N$17
  Top 0.254: Y4.1 23.76,11.25 27.07,11.28 U$4.9 | Y4.1 22.22,12.94 22.52,12.94 C14.1 | R11.1 20.99,11.57 Y4.1
N$18
  Top 0.254: Y4.3 25.62,10.79 U$4.10 | Y4.3 23.21,10.4 21.21,10.4 R11.2 | Y4.3 24.52,7.18 C15.1
N$19
  Top 0.254: C10.1 C9.1 | C9.1 27.88,8.9 U$4.11 | C9.1 27.89,8.54 28.54,8.54 29.09,7.99 L2.2
N$20
  Top 0.254: L6.1 L5.1 30.37,9.47 29.13,9.47 28.88,9.73 U$4.13
N$21
  Top 0.254: C8.2 31.32,13.6 31.32,12.55 31.06,12.29 U$4.19
N$23
  Top 0.254: L2.1 30.39,8.15 L5.2 29.18,8.66 28.38,9.47 U$4.12
N$24
  Top 0.254: U$4.16 30.68,10.65 31.29,10.03 32.17,10.03 R12.1
N$25
  Top 0.254: L6.2 34.81,8.66 C13.1
N$26
  Top 0.254: C12.1 36.78,6.85 C13.2 34.92,4.83 37.22,2.54 U$2.FEED
N$27
  Top 0.254: U1.32 24.67,42.91 C29.2 22.49,43.17 Y2.3
N$28
  Top 0.254: U1.33 20.04,38.02 C30.2 18.66,41.01 Y2.1
N$29
  Top 0.254: LED4.A R17.2
N$30
  Top 0.254: 11.89,51.56 11.89,51.59 11.94,51.59
N$32
  Top 0.254: U$6.MTCK/12 16.88,16.41 R5.2
N$34  (via drill 0.6)
  Top 0.178: U3.10 11.21,37.24 11.71,37.74 v11.71,37.97
  Top 0.254: C27.2 11.38,40.87 v10.41,39.9
  Bottom 0.178: v10.41,39.9 10.41,39.27 v11.71,37.97
N$35  (via drill 0.6)
  Top 0.178: U$3.6 11.61,23.32 12.85,24.56 v12.85,25.09
  Top 0.254: v14.88,25.68 16.67,25.68 R18.1
  Bottom 0.178: v12.85,25.09 12.85,25.17 13.31,25.63
  Bottom 0.254: v14.88,25.68 13.44,25.68 v12.85,25.09
N$36
  Top 0.178: 11.89,52.32 11.89,52.4
N$37
  Top 0.178: 11.89,50.95 11.89,50.93
N$38
  Top 0.254: U$6.RES12K/31 10.97,15.41 10.59,15.04 9.6,15.04 4.64,10.07 R1.1
N$39  (via drill 0.6)
  Top 0.254: R26.2 44.23,46.99 43.56,46.99 41.53,44.96 41.53,39.5 43.31,37.72 43.31,32.38 v45.97,29.72 | v50.42,29.46 53.53,29.46 U$8.R
  Bottom 0.254: v45.97,29.72 50.16,29.72 v50.42,29.46
N$40
  Top 0.254: U$20.24 48.23,48.74 50.16,50.67 51.9,50.67 R19.1
N$41
  Top 0.254: U$8.B 54.3,30.35 48.77,30.35 44.32,34.8 44.32,38.23 42.55,40.01 42.55,43.05 44.3,44.81 R27.2
N$42
  Top 0.254: U$8.G 48.89,28.45 43.81,33.53 43.81,37.97 42.04,39.75 42.04,43.63 R25.2
N$45
  Top 0.254: U$11.B 54.3,32.92 50.32,32.92 45.85,37.39 45.85,38.99 44.45,40.39 R28.2 44.46,40.98
N$46  (via drill 0.6)
  Top 0.254: 44.27,43.61 R29.2 43.87,43.61 43.05,42.8 43.05,40.26 44.83,38.48 44.83,35.74 v48.56,32 | v51.49,32.03 53.58,32.03 U$11.R
  Bottom 0.254: v48.56,32 51.46,32 v51.49,32.03
N$47
  Top 0.254: R30.2 43.94,42.39 43.56,42.01 43.56,40.51 45.34,38.73 45.34,36.75 51.1,30.99 U$11.G
N$48
  Top 0.254: U$20.3 46.82,44.47 46.48,44.81 R27.1
N$49
  Top 0.254: U$20.1 47.31,45.47 47.19,45.59 47.19,46.74 46.74,47.19 R26.1
N$50
  Top 0.254: R31.2 50.55,37.41 52.5,35.46 54.76,35.46 55.06,35.16 U$13.B
N$51
  Top 0.254: U$20.6 47.37,42.97 47.24,42.85 47.24,42.27 46.15,41.17 R28.1
N$60  (via drill 0.6)
  Top 0.254: U$13.R 52.12,34.69 v49.68,37.13 | v47.4,37.49 47.4,39.25 R32.2
  Bottom 0.254: v49.68,37.13 47.75,37.13 v47.4,37.49
N$61
  Top 0.254: R33.2 48.56,36.4 51.43,33.53 U$13.G
N$62
  Top 0.254: R34.2 55.06,41.96 U$14.B
N$63
  Top 0.254: R35.2 53.7,37.29 U$14.R
N$73
  Top 0.254: U$20.2 47.15,44.97 46.74,45.39 46.74,45.74 46.46,46.02 R25.1
N$75
  Top 0.254: U$20.4 46.12,43.97 R29.1
N$76
  Top 0.254: U$20.5 47.05,43.47 45.97,42.39 R30.1
N$78
  Top 0.254: U$20.7 48.23,42.16 47.37,41.3 R32.1
N$79
  Top 0.254: U$20.8 48.73,40.74 R33.1
N$80
  Top 0.254: U$20.10 49.73,41.89 50.44,41.17 50.44,40.68 R31.1
N$81  (via drill 0.6)
  Top 0.254: R36.2 53.61,39.28 v54.03,38.86 | v52.76,37.08 52.76,36.4 53.08,36.07 U$14.G
  Bottom 0.254: v54.03,38.86 54.03,38.35 v52.76,37.08
N$82
  Top 0.254: U$20.11 50.23,42.02 50.8,41.45 51.54,41.45 51.64,41.35 51.64,40.66 R35.1
N$83
  Top 0.254: U$20.12 50.73,42.16 50.98,41.91 52.4,41.91 52.88,41.43 R36.1
N$84
  Top 0.254: U$20.13 52.75,42.97 R34.1
N$86
  Top 0.254: U$15.B 54.45,20.07 52.58,20.07 52.2,19.68 52.2,16.13 50.11,14.05 R37.2
N$87
  Top 0.254: U$20.23 48.73,48.48 50.42,50.16 53.91,50.16 R20.1 55.27,51.46
N$88
  Top 0.254: U$20.22 49.23,48.21 50.67,49.66 55.89,49.66 R21.1
N$89  (via drill 0.6)
  Top 0.254: U$15.R 53.23,19.45 52.83,19.05 v52.83,15.49 | R38.2 49.7,11.43 52.45,11.43 52.83,11.81 v52.83,12.57
  Bottom 0.254: v52.83,12.57 v52.83,15.49
N$92
  Top 0.254: U$21.1 46.36,13.25 47.95,11.66 R38.1
N$93
  Top 0.254: U$21.2 46.8,13.75 47.7,12.85 R39.1
N$94
  Top 0.254: U$21.3 47.96,14.25 R37.1
N$95
  Top 0.254: U$21.4 46.68,14.75 47.14,15.21 R41.1
N$96
  Top 0.254: U$21.5 46.52,15.25 47.65,16.38 R42.1
N$97
  Top 0.254: U$21.6 46.39,15.75 46.58,15.95 46.58,16.74 47.37,17.53 R40.1
N$98
  Top 0.254: U$21.7 45.47,16.59 46.46,17.58 R44.1
N$99
  Top 0.254: U$21.8 44.97,18.01 R45.1
N$100
  Top 0.254: R39.2 49.49,12.83 51.69,12.83 53.72,14.86 53.72,18.27 U$15.G 53.85,18.15
N$101
  Top 0.254: U$21.10 43.97,17.79 R43.1
N$102
  Top 0.254: U$21.11 43.47,16.93 42.88,17.53 42.34,17.53 42.14,17.73 R47.1
N$103
  Top 0.254: U$21.12 42.97,16.67 42.65,16.99 41.33,16.99 40.95,17.37 R48.1
N$104
  Top 0.254: U$21.13 R46.1
N$106
  Top 0.254: U$21.24 45.47,12.39 46.99,10.87 47.98,10.87 48.44,10.41 49.74,10.41 R24.1
N$107
  Top 0.254: U$21.23 44.97,12.23 46.81,10.39 47.83,10.39 48.62,9.6 R23.1
N$108
  Top 0.254: U$21.22 44.47,12.04 46.58,9.93 R22.1
N$109
  Top 0.254: U$16.B 54.32,22.73 51.94,22.73 49.47,20.26 R40.2
N$110  (via drill 0.6)
  other vias: 6.99,27.18
N$112
  Top 0.254: U$16.R 52.09,21.99 51.56,21.46 51.56,16.38 50.39,15.21 R41.2
N$113  (via drill 0.6)
  Top 0.254: R42.2 50.29,16.38 50.67,16.76 v50.67,18.8 | U$16.G 53.44,21.08 v52.58,21.08
  Bottom 0.254: v50.67,18.8 50.67,19.18 v52.58,21.08
N$114
  Top 0.254: R43.2 48.75,25.15 54.36,25.15 54.97,24.53 U$17.B
N$115
  Top 0.254: U$17.R 50.82,24.53 46.46,20.17 R44.2
N$116  (via drill 0.6)
  Top 0.254: R45.2 45.34,19.68 45.34,20.45 46.41,21.51 v46.48,21.51 | U$17.G 51.19,23.37 v50.67,22.86
  Bottom 0.254: v46.48,21.51 49.33,21.51 v50.67,22.86
N$117
  Top 0.254: R46.2 39.56,20.76 46.48,27.69 54.45,27.69 U$18.B
N$118
  Top 0.254: R47.2 49.48,27.07 U$18.R
N$119  (via drill 0.6)
  Top 0.254: U$18.G 50.29,25.91 v50.04,26.16 | v46.99,26.29 40.95,20.24 R48.2
  Bottom 0.254: v50.04,26.16 49.66,26.54 47.24,26.54 v46.99,26.29
PS
  Top 0.254: U2.8 13.11,53.98 12.5,54.59
  Top 0.406: 12.5,54.59 12.5,57.38 12.75,57.63 15.04,57.63
  Top 0.61: 15.04,57.63 19,57.63 20.64,55.99 R2.2
PTA0  (via drill 0.6)
  Top 0.254: R50.2 36.54,50.16 v38.99,50.16 42.04,50.16 42.9,51.03 U$7.4 | U1.22 29.67,38.15 v29.84,37.97
  Bottom 0.254: v38.99,50.16 38.99,46.61 30.35,37.97 v29.84,37.97
PTA1  (via drill 0.6)
  Top 0.254: R52.2 39.09,51.49 U$7.8 | U1.23 29.17,38.57 28.07,37.47 28.07,36.96 28.32,36.7 v29.08,36.7
  Bottom 0.254: U$7.8 40.36,47.22 29.84,36.7 v29.08,36.7
PTA2  (via drill 0.6)
  Top 0.254: U1.24 28.67,38.83 27.56,37.72 27.56,35.69 27.81,35.43 v28.57,35.43
  Bottom 0.254: U$7.6 41.63,47.73 29.34,35.43 v28.57,35.43
PTA3  (via drill 0.6)
  Top 0.254: U1.25 28.17,39.09 27.05,37.97 27.05,34.67 27.81,33.91 v28.07,33.91 | R49.2 U$7.2
  Bottom 0.254: U$7.2 44.17,49.51 28.57,33.91 v28.07,33.91
PTB0
  Top 0.178: 10.4,36.84 U3.12 10.4,38.73 11.02,39.34 12.47,39.34 14.8,37.02 U1.35
PTB1
  Top 0.178: U1.36 14.67,36.52 12.29,38.89 11.33,38.89 10.8,38.36 U3.11
PTB16  (via drill 0.6)
  Top 0.254: U1.39 18.38,35.02 16.64,33.27 16.64,28.45 16.38,28.19 10.29,28.19 v6.73,24.64 | U$6.U0TXD/26 8.38,17.91 v8,18.29
  Bottom 0.254: v8,18.29 6.73,19.56 v6.73,24.64
PTB17  (via drill 0.6)
  Top 0.254: U1.40 18.51,34.52 17.14,33.15 17.14,27.81 16.64,27.3 v16.13,27.3 | v12.57,27.3 10.9,27.3 7.24,23.65 7.24,20.32 9.15,18.41 U$6.U0RXD/25
  Bottom 0.254: v12.57,27.3 v16.13,27.3
PTB18
  Top 0.254: U1.41 18.77,34.02 17.65,32.89 17.65,27.69 21.36,23.98 21.36,19.48 20.85,18.97 17.3,18.97 16.24,17.91 U$6.GPIO0/15
PTB19
  Top 0.254: U1.42 19.04,33.52 18.16,32.64 18.16,28.07 21.87,24.36 21.87,19.23 21.11,18.47 17.55,18.47 16.5,17.41 U$6.GPIO2/14
PTC0  (via drill 0.6)  (1 unrouted)
  Top 0.254: U$6.EXT_RSTB/32 11.18,14.91 10.95,14.68 | U1.43 19.3,33.02 18.67,32.38 18.67,29.34 v21.97,26.04 | 10.44,13.89 v10.44,13.13 9.45,13.13 R15.1
  Bottom 0.254: v10.44,13.13 10.69,12.88 14.25,12.88 19.33,17.96 21.39,17.96 22.35,18.92 22.35,25.65 v21.97,26.04
PTC1  (via drill 0.6)
  Top 0.254: v22.38,27.41 21.21,28.57 20.19,28.57 19.18,29.59 19.18,32.13 19.56,32.52 U1.44 | U$6.CHIP_EN/7 14.97,12.36 v15.29,12.04
  Bottom 0.254: v22.38,27.41 22.86,26.92 22.86,18.67 21.59,17.4 19.81,17.4 16.13,13.72 16.13,12.45 15.72,12.04 v15.29,12.04
PTC3  (via drill 0.6)
  Top 0.254: U$6.XPD_DCDC/8 15.47,13.62 v17.14,12.19 | v22.99,17.53 22.99,25.65 24,26.67 24,29.72 24.26,29.97 v25.53,29.97 | U1.46 24.02,31.52 24.77,32.26 24.77,32.51 25.02,32.77 v25.53,32.77
  Bottom 0.254: v25.53,32.77 25.78,32.51 25.78,30.23 v25.53,29.97 | v22.99,17.53 22.35,16.89 20.32,16.89 19.43,16 19.43,13.84 17.78,12.19 v17.14,12.19
PTC4  (via drill 0.6)
  Top 0.254: v24.26,25.27 24.26,25.78 24.67,26.2 U1.49 | U$4.2 29.38,19.01 v28.32,20.07
  Bottom 0.254: v24.26,25.27 24.77,24.77 26.42,24.77 27.94,23.24 27.94,20.45 v28.32,20.07
PTC5  (via drill 0.6)
  Top 0.254: v26.16,20.32 25.17,21.31 U1.50 | U$4.3 28.88,17.6 v27.43,19.05
  Bottom 0.254: v27.43,19.05 v26.16,20.32
PTC6  (via drill 0.6)
  Top 0.254: U1.51 25.67,23.6 26.04,23.24 v26.04,22.73 | U$4.4 28.38,16.32 v26.54,18.16
  Bottom 0.254: v26.04,22.73 26.04,21.59 25.15,20.7 25.15,19.56 v26.54,18.16
PTC7
  Top 0.254: 26.19,28.55 U1.52 26.17,24.37 27.18,23.37 27.18,20.07 25.65,18.54 25.65,17.65 27.88,15.43 U$4.5
PTC8  (via drill 0.6)
  Top 0.254: U1.53 26.67,25.4 28.96,23.11 v28.96,21.84 | v26.04,15.88 26.04,15.24 26.54,14.73 26.54,13.21 26.96,12.79 U$4.6
  Bottom 0.254: v28.96,21.84 29.34,21.46 29.34,19.68 26.04,16.38 v26.04,15.88
PTC9
  Top 0.254: U1.54 27.17,25.66 29.88,22.95 U$4.1
PTC10  (via drill 0.6)
  Top 0.254: U1.55 27.67,25.92 30.23,23.37 34.52,23.37 v37.19,20.7
  Bottom 0.254: JP1.12 56.64,17.4 44.58,17.4 41.27,20.7 v37.19,20.7
PTC11  (via drill 0.6)
  Top 0.254: U1.56 28.17,26.18 30.48,23.88 35.87,23.88 v38.18,21.57
  Bottom 0.254: JP1.11 56.87,21.41 54.38,23.9 46.61,23.9 44.27,21.57 v38.18,21.57
PTD0  (via drill 0.6)
  Top 0.254: U1.57 28.67,26.45 30.73,24.38 37.47,24.38 v39.4,22.45
  Bottom 0.254: JP1.10 57.53,24.54 46.05,24.54 43.97,22.45 v39.4,22.45
PTD1  (via drill 0.6)
  Top 0.254: U1.58 29.17,26.71 30.99,24.89 38.94,24.89 v40.31,23.52
  Bottom 0.254: JP1.9 56.82,25.2 45.67,25.2 43.99,23.52 v40.31,23.52
PTD2  (via drill 0.6)
  Top 0.254: U1.59 29.67,26.97 31.24,25.4 40.49,25.4 v41.22,24.66
  Bottom 0.254: JP1.8 56.69,27.61 46.74,27.61 43.79,24.66 v41.22,24.66
PTD3  (via drill 0.6)
  Top 0.254: U1.60 30.17,27.23 31.5,25.91 42.04,25.91 v42.19,25.76
  Bottom 0.254: 51.71,28.42 51.74,28.45 | 51.74,28.45 54.86,31.57 JP1.7 | 51.74,28.45 46.56,28.45 43.87,25.76 v42.19,25.76
PTD4  (via drill 0.6)
  Top 0.254: U1.61 30.67,27.49 31.75,26.42 40.26,26.42 40.64,26.8 v43.23,26.8
  Bottom 0.254: JP1.6 57.38,33.38 46.63,33.38 44.96,31.7 44.96,27.79 43.97,26.8 v43.23,26.8
PTD5  (via drill 0.6)
  Top 0.254: U1.62 31.17,27.75 32,26.92 39.88,26.92 41.02,28.07 v43.99,28.07
  Bottom 0.254: JP1.5 57.68,36.22 46.89,36.22 44.35,33.68 44.35,28.42 v43.99,28.07
PTD6
  Top 0.254: U1.63 31.67,27.89 31.88,27.69 33.24,27.69 R8.1
PTD7  (via drill 0.6)
  Top 0.254: R17.1 8.62,30.23 v15.62,30.23 | v29.59,29.97 31.62,29.97 32.17,29.42 U1.64
  Bottom 0.254: v15.62,30.23 23.75,30.23 25.02,28.96 28.57,28.96 v29.59,29.97
RESET_B  (via drill 0.6)
  Top 0.254: U1.34 24.05,37.52 v24.51,37.97 | R53.2 36.49,52.76 U$7.10 | v26.54,49.53 v26.54,46.86
  Bottom 0.254: v24.51,37.97 25.53,37.97 26.54,38.99 v26.54,46.86 | U$7.10 37.13,50.8 27.3,50.8 26.54,50.04 v26.54,49.53
SCL  (via drill 0.6)
  Top 0.178: U3.23 12.01,34.74 12.45,35.18 13.31,35.18 14.14,36.02 U1.37
  Top 0.254: U$20.19 50.73,46.66 50.93,46.86 51.82,46.86 52.32,46.35 53.21,46.35 53.72,46.86 v53.72,47.62 | U1.37 24.08,36.02 v24.51,36.45 | U$21.19 42.97,12.24 42.8,12.06 40.39,12.06 37.97,14.48 v37.97,14.91 | 36.4,19.14 R14.2 35.12,18.93 v34.06,19.99 v34.06,22.17
  Bottom 0.254: v53.72,47.62 53.72,48.39 53.21,48.9 51.44,48.9 49.91,47.37 44.58,47.37 38.48,41.27 38.48,34.42 36.7,32.64 36.7,29.54 33.78,26.62 | v24.51,36.45 24.77,36.45 25.27,35.94 25.27,35.18 28.96,31.5 30.1,31.5 33.78,27.81 33.78,26.62 | 33.78,26.62 33.78,23.11 34.06,22.84 v34.06,22.17 | v34.06,19.99 34.06,19.15 34.92,18.29 36.96,18.29 37.97,17.27 v37.97,14.91
SD-CLK
  Top 0.178: 16.51,21.51 15.67,21.51 15.01,22.17 13.79,22.17 13.41,21.8 13.41,18.96 U$6.SD_CLK/21
  Top 0.254: 16.51,21.51 17.4,21.51 17.68,21.79 17.68,22.98 R18.2
SD-CMD
  Top 0.178: U$3.1 15.92,21.01 15.6,21.01 14.86,21.74 14.17,21.74 13.82,21.39 13.82,20.04 13.97,19.89 U$6.SD_CMD/20
SD-D0
  Top 0.178: U$3.2 15.49,22.63 13.56,22.63 12.97,22.03 U$6.SD_DATA_0/22
SD-D1  (via drill 0.6)
  Top 0.178: v10.92,19.58 12.17,19.58 12.47,19.28 U$6.SD_DATA_1/23 | U$3.5 11.59,25.64 v11.35,25.88
  Bottom 0.178: v11.35,25.88 11.15,25.88 10.92,25.65 10.92,20.32 10.67,20.07 10.67,19.84 v10.92,19.58
SD-D2  (via drill 0.6)
  Top 0.178: U$3.7 11.98,22.13 13.08,23.23 v13.08,23.42 | v17.07,20.5 16.94,20.37 15.42,20.37 14.97,19.92 U$6.SD_DATA_2/18
  Bottom 0.178: v13.08,23.42 13.08,23.75 13.89,24.56 15.37,24.56 17.07,22.86 v17.07,20.5
SD-D3  (via drill 0.6)
  Top 0.178: v14.63,23.55 14.83,23.75 15.58,23.75 U$3.3 | U$6.SD_DATA_3/19 14.47,20.64 v14.61,20.78
  Bottom 0.178: v14.61,20.78 14.61,23.52 v14.63,23.55
SDA  (via drill 0.6)
  Top 0.178: U3.24 12.4,34.5 12.68,34.77 13.56,34.77 14.31,35.52 U1.38
  Top 0.254: U$21.20 43.47,11.97 43.05,11.56 40.09,11.56 37.01,14.64 37.01,15.62 37.41,16.03 38.35,16.03 38.89,16.56 38.89,18.11 38.04,18.96 R13.2 | R13.2 37.41,19.04 | U$20.20 50.23,47.05 51.18,48.01 52.07,48.01 v52.2,47.88 | v35.08,21.18 36.4,19.86 37.44,19.86 37.74,19.56 R13.2 | U1.38 23.67,35.52 v24.77,34.42
  Bottom 0.254: v52.2,47.88 52.45,47.62 52.45,46.99 51.69,46.23 44.2,46.23 38.99,41.02 38.99,34.16 37.21,32.38 37.21,29.34 34.29,26.42 34.29,24.64 35.08,23.85 v35.08,21.18 33.43,21.18 32.89,21.72 32.89,23.5 33.15,23.75 33.15,27.69 29.84,30.99 28.7,30.99 25.27,34.42 v24.77,34.42
SOFTPOWER
  Top 0.254: U2.6 14.11,53.65 14.28,53.82 14.78,53.82 15.54,53.06
  Top 0.406: 15.54,53.06 16.09,53.06 R10.1
UVLO
  Top 0.254: U2.7 13.61,54.46 R4.2
  Top 0.406: R3.1 15.79,54.24 16.38,53.65 17.36,53.65 C2.2
  Top 1.016: R4.2 13.88,54.66 R3.1
VAUX  (via drill 0.6)
  Top 0.254: U2.1 12.11,49.75 11.81,49.45
  Top 0.406: 11.81,49.45 11.56,49.45 v11.05,49.96
  Top 0.61: v8.43,47.98 8.38,48.03 C4.1
  Bottom 0.61: v11.05,49.96 10.79,49.96 8.81,47.98 v8.43,47.98
VCC  (via drill 0.6)
  Top 0.254: U2.5 14.11,49.7 14.35,49.45
  Top 0.406: 14.35,49.45 14.99,49.45 | R10.2 17.63,49.87 C2.1 19.54,49.99 20.5,49.99 20.93,50.42 20.93,52.12 20.24,52.81 19.79,52.81 18.94,53.66 R2.1
  Top 0.61: 14.99,49.45 15.56,49.45 | 15.56,49.45 C1.1 15.95,49.85 R10.2 | 15.56,49.45 16.33,48.68 L1.2 | R3.2 R2.1
  Top 0.813: L1.2 16.33,45.41 15.37,44.45 v11.56,44.45 | S1.1 4.76,36 v5.71,36.96
  Bottom 0.813: v11.56,44.45 7.49,44.45 5.71,42.67 v5.71,36.96
VDDA
  Top 0.254: 36.55,36.39 R16.1 | R16.1 36.37,36.52 U1.13 | L3.1 39.55,34.96 39.55,35.41 38.73,36.22 C17.1 36.58,36.59 R16.1
VRAW  (via drill 0.6)
  Top 0.813: v6.99,41.91 7.07,41.91 5.97,40.81 5.97,39.37 4.1,37.5 S1.2
  Bottom 0.813: JP5.2 30.4,54.05 28.96,55.5 25.91,55.5 12.32,41.91 v6.99,41.91
VREF_OUT  (via drill 0.6)
  Top 0.254: C16.1 35.59,34.1 v35.59,33.98 | U1.17 32.13,39.92 v32.13,34.77
  Bottom 0.254: v35.59,33.98 35.59,31.47 34.72,30.61 32.64,30.61 32.13,31.11 v32.13,34.77
VREFH
  Top 0.254: C11.1 36.52,39.51 R16.2 35.48,37.02 U1.14
VREFL  (via drill 0.6)
  Top 0.254: U1.15 U1.16 34.12,38.82 36.22,40.92 37.55,40.92 C11.2 | C11.2 38.73,39.74 C17.2 39.75,37.22 39.75,36.42 40.47,35.7 L4.2 | v39.93,39.9 38.62,39.9 C11.2 | C16.2 38.34,33.62 v39.24,32.72
  Bottom 0.254: v39.93,39.9 40.11,39.73 40.11,33.05 39.78,32.72 v39.24,32.72
XTAL_IN
  Top 0.254: C23.1 Y3.3 6.22,16.91 U$6.XTAL_IN/28
XTAL_OUT
  Top 0.254: 2.79,21.11 C7.1 3.21,19.91 Y3.1 4.85,17.41 U$6.XTAL_OUT/27